# EasyEDA Pro project Octoslime_Haptics.eprj

# Schematic Octoslime

## Sheets
1 I2C breakout and OLED
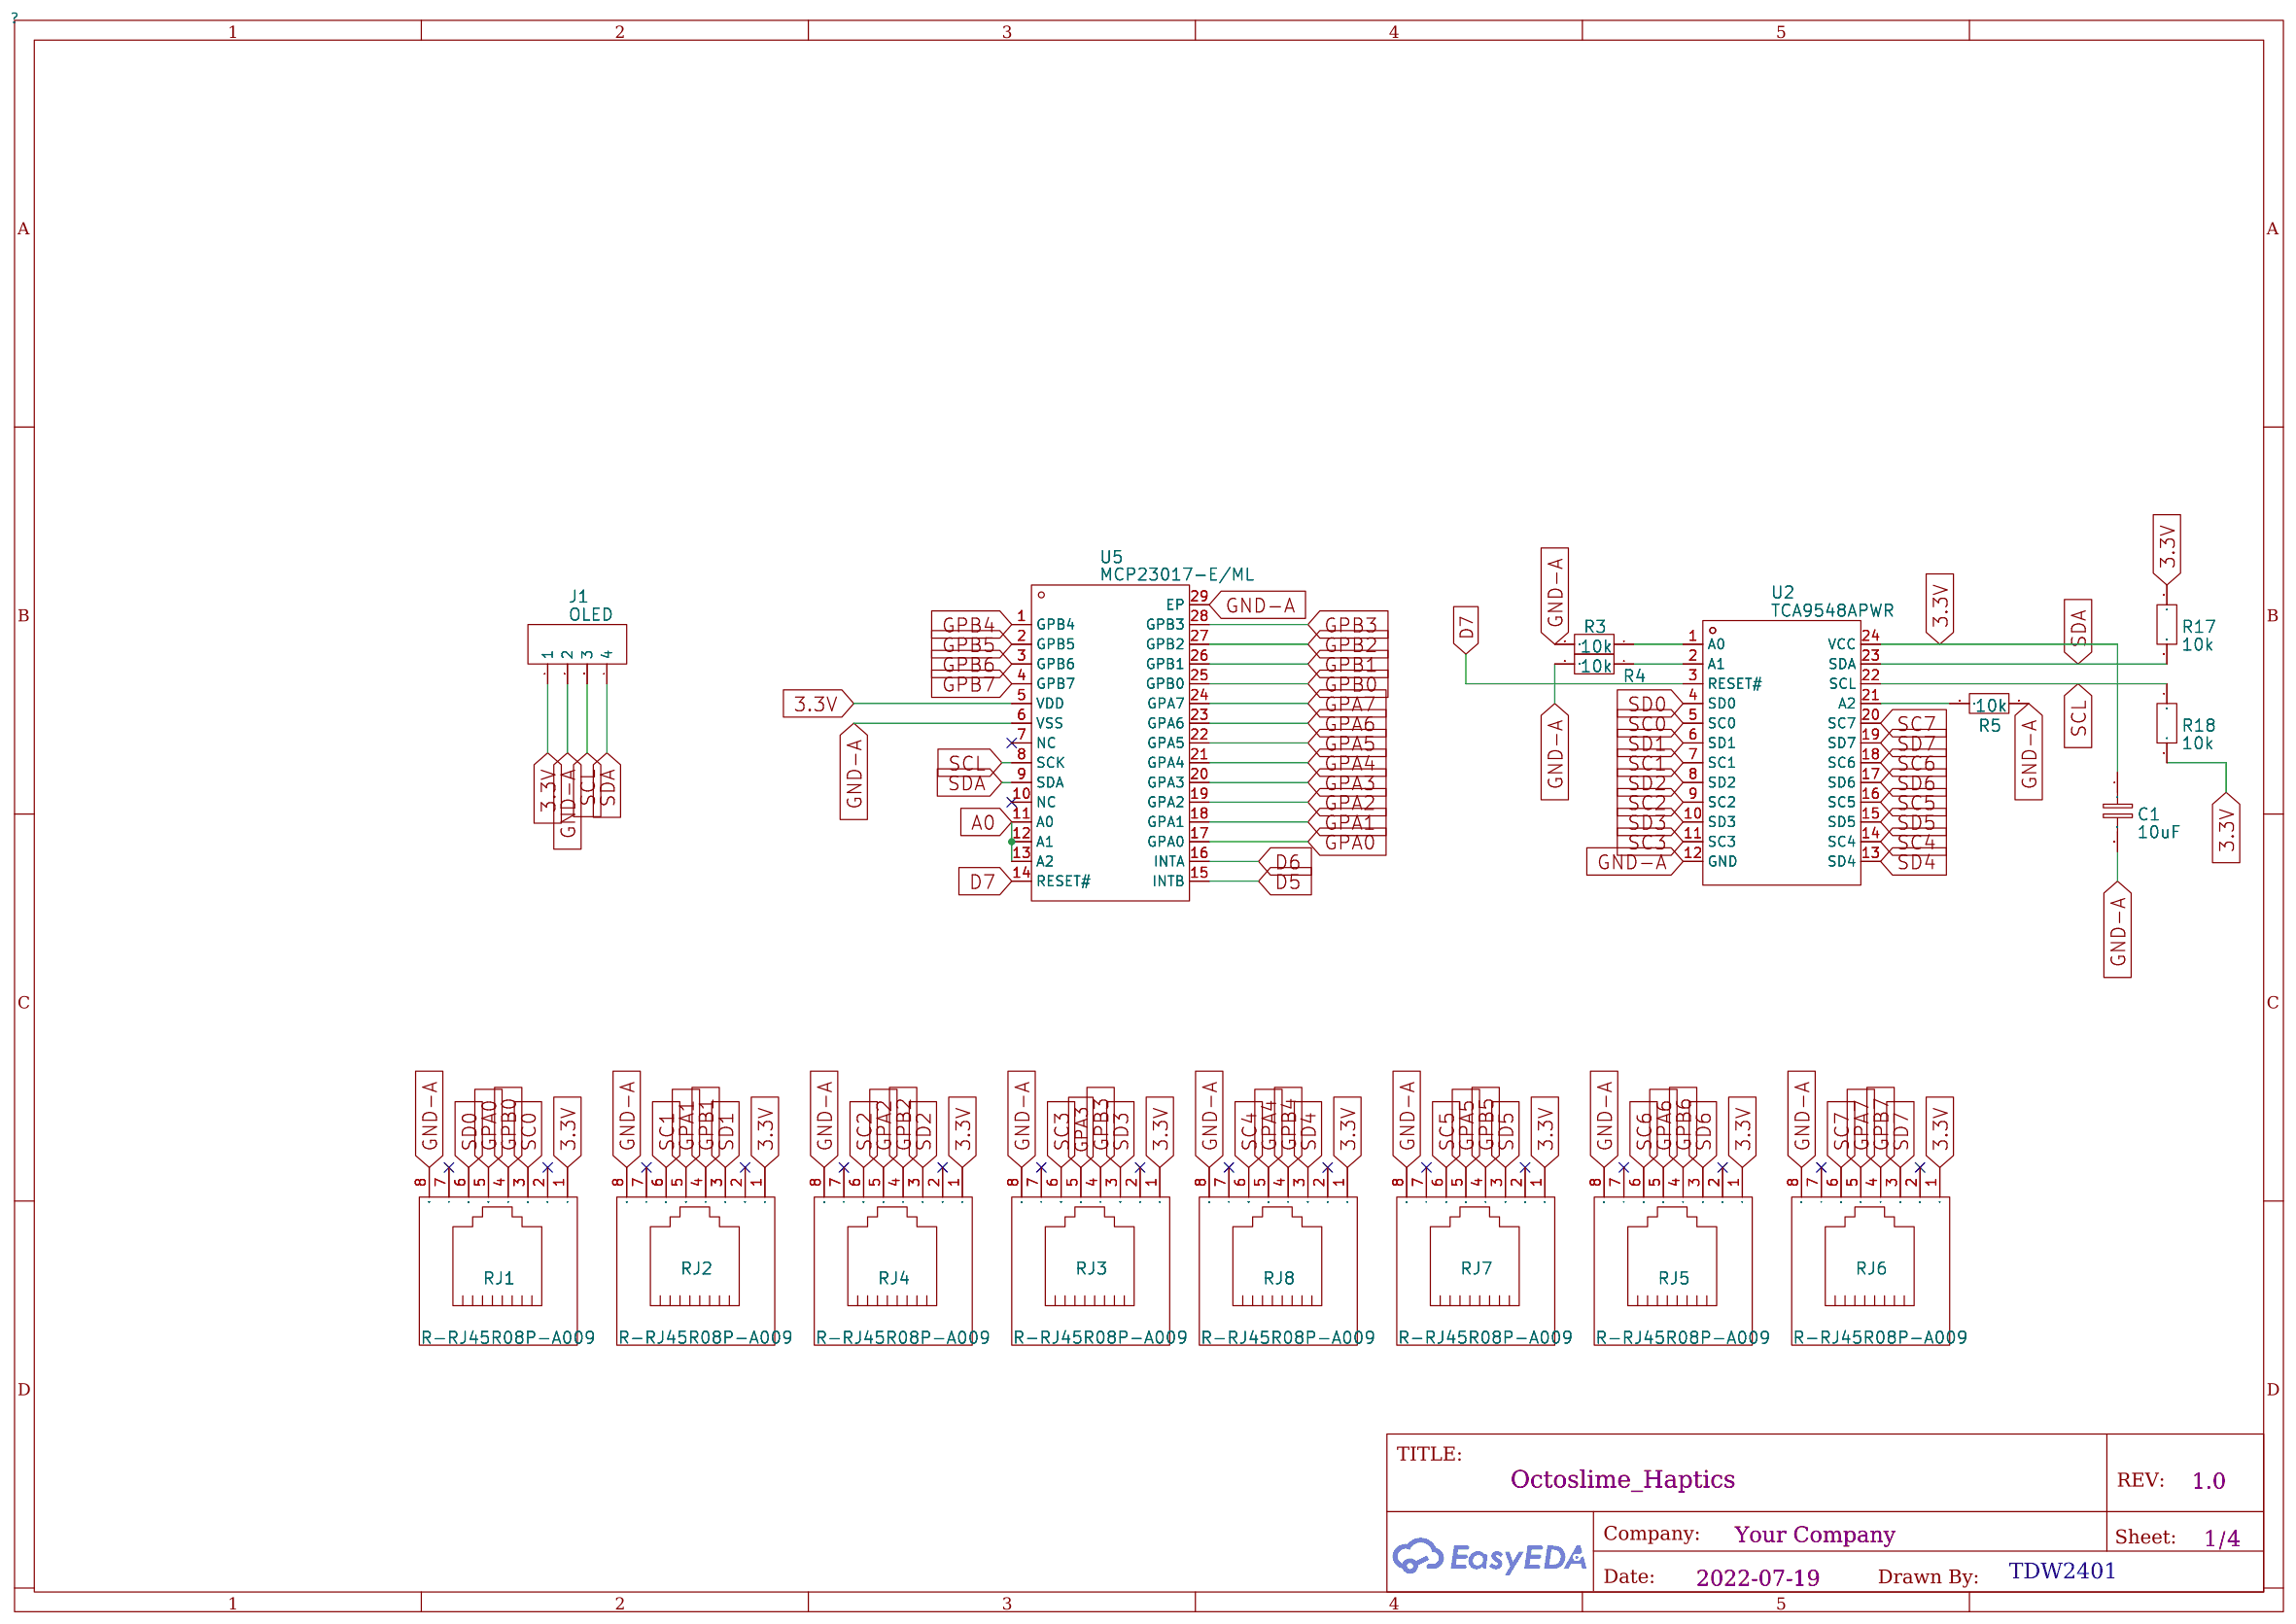
[diagram p0: I2C breakout and OLED]
2 Charge / data
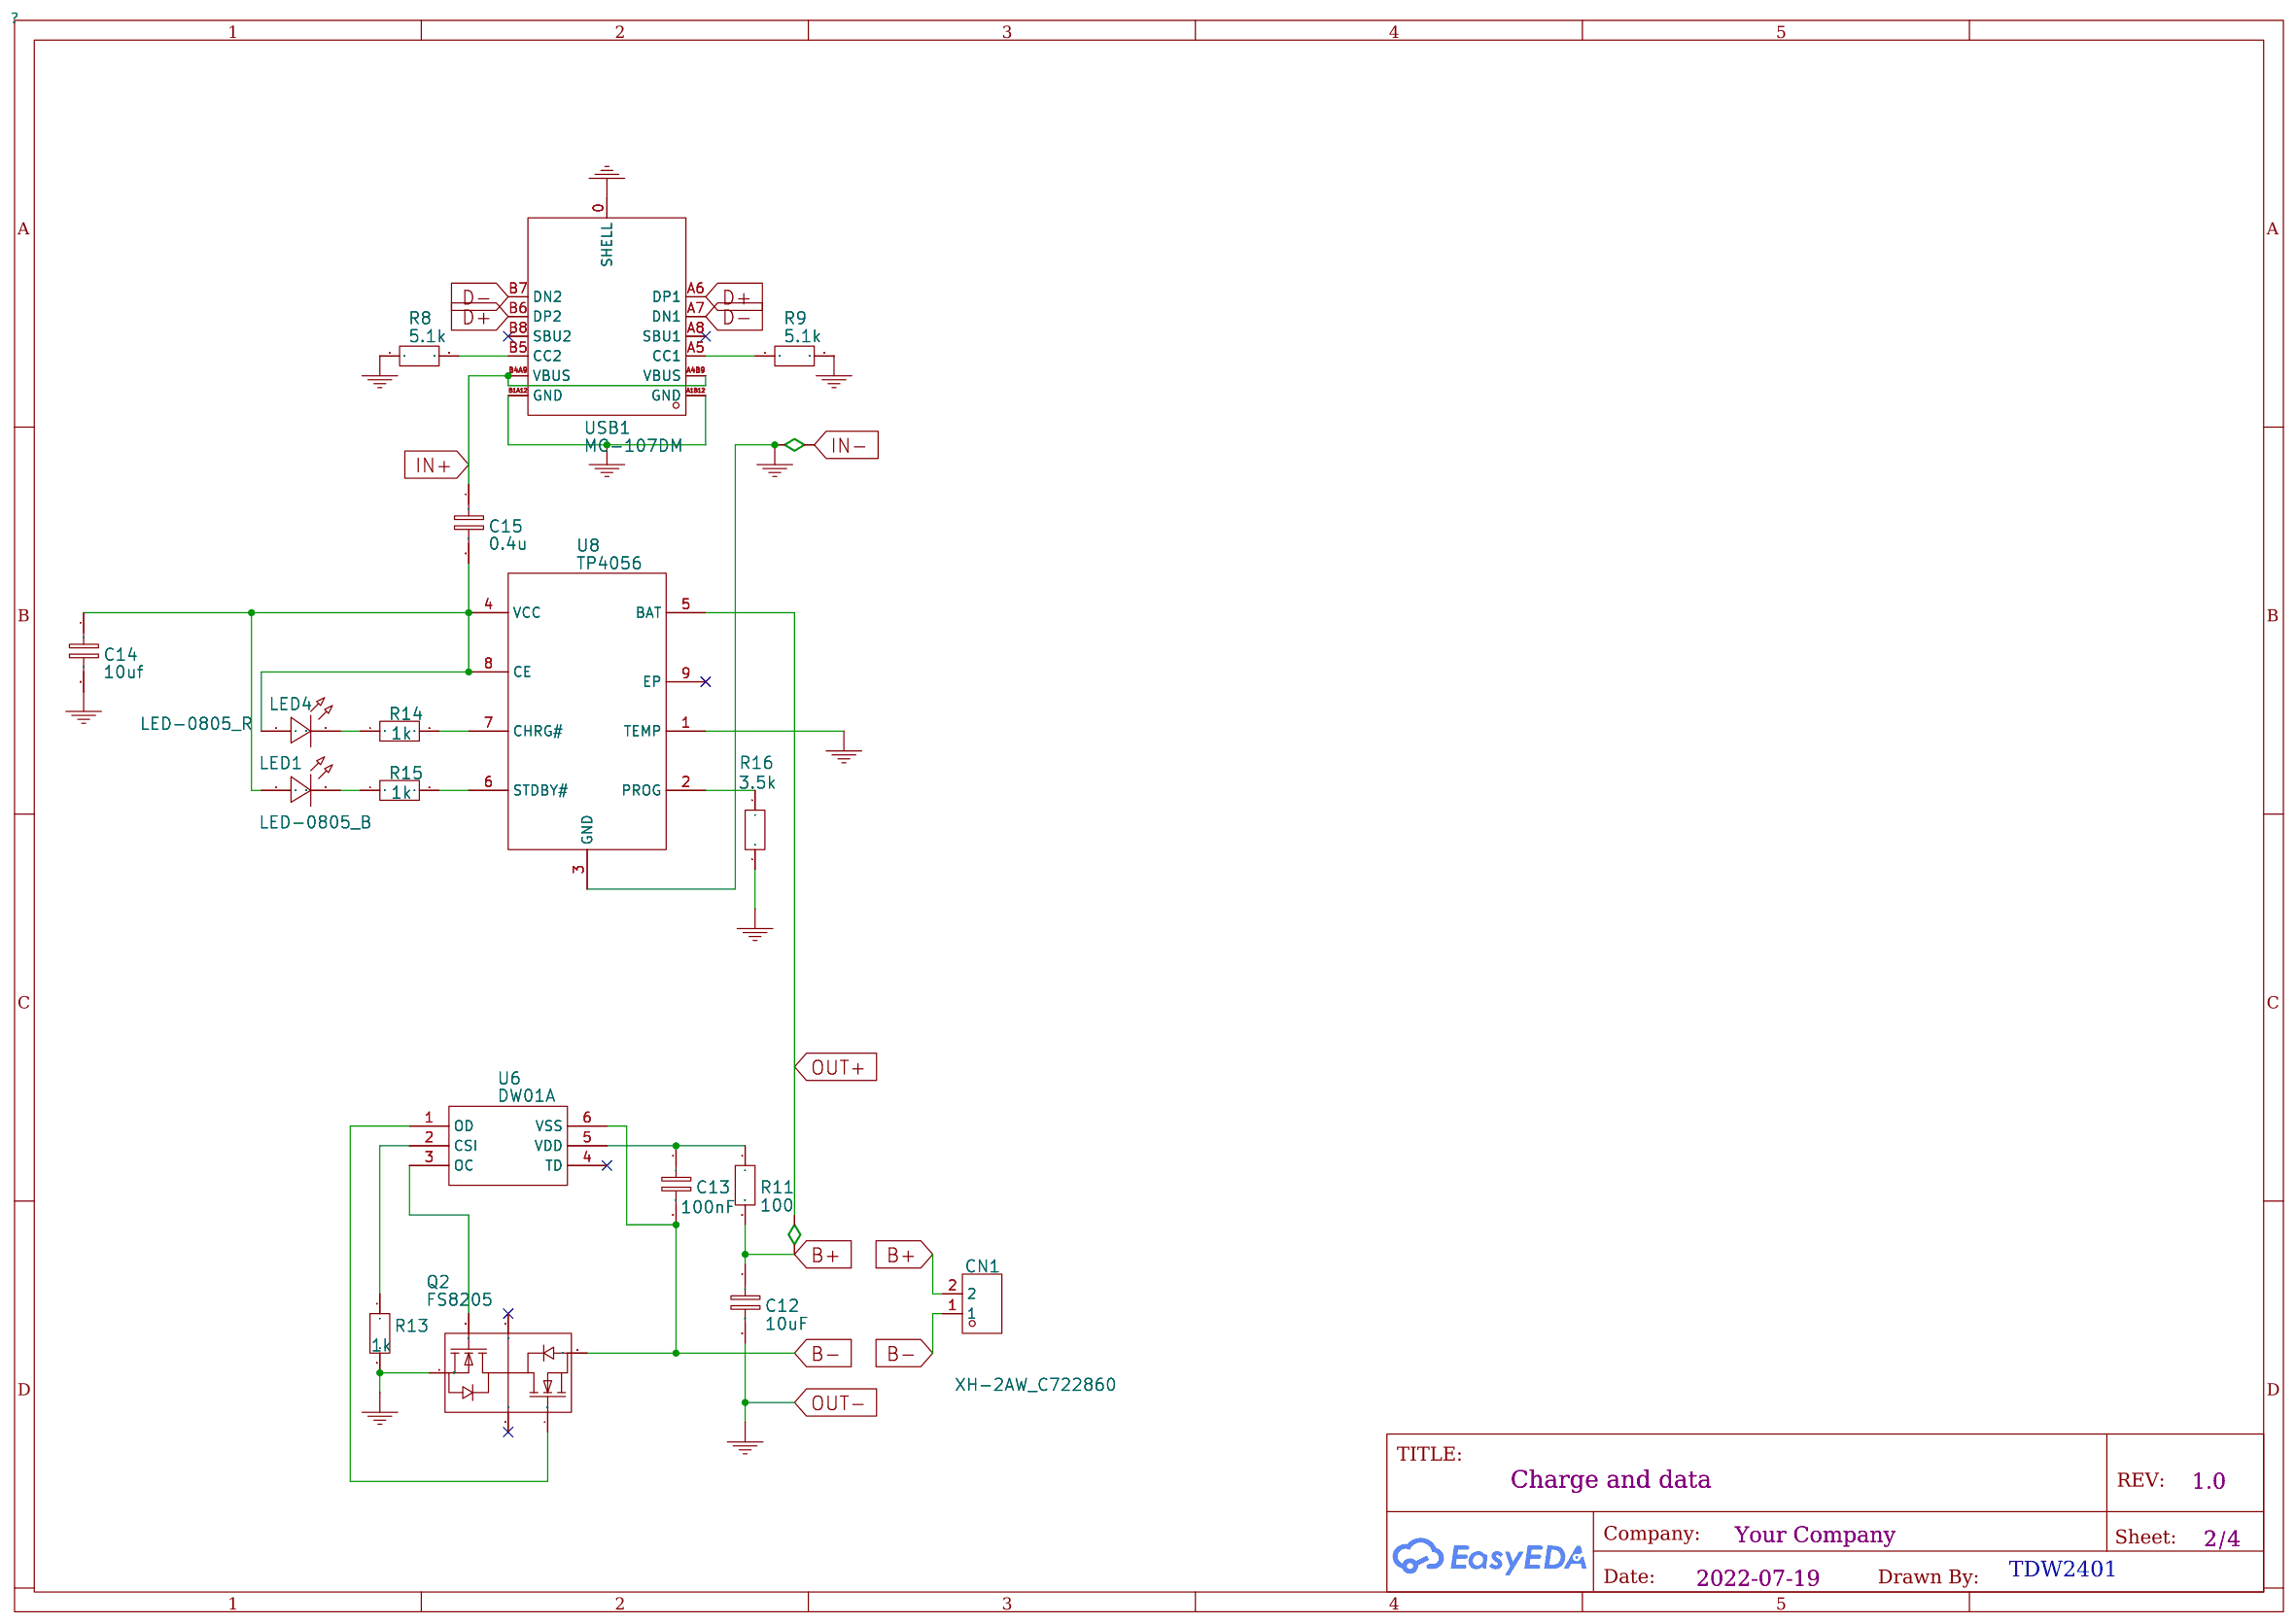
[diagram p1: Charge / data]
3 MCU
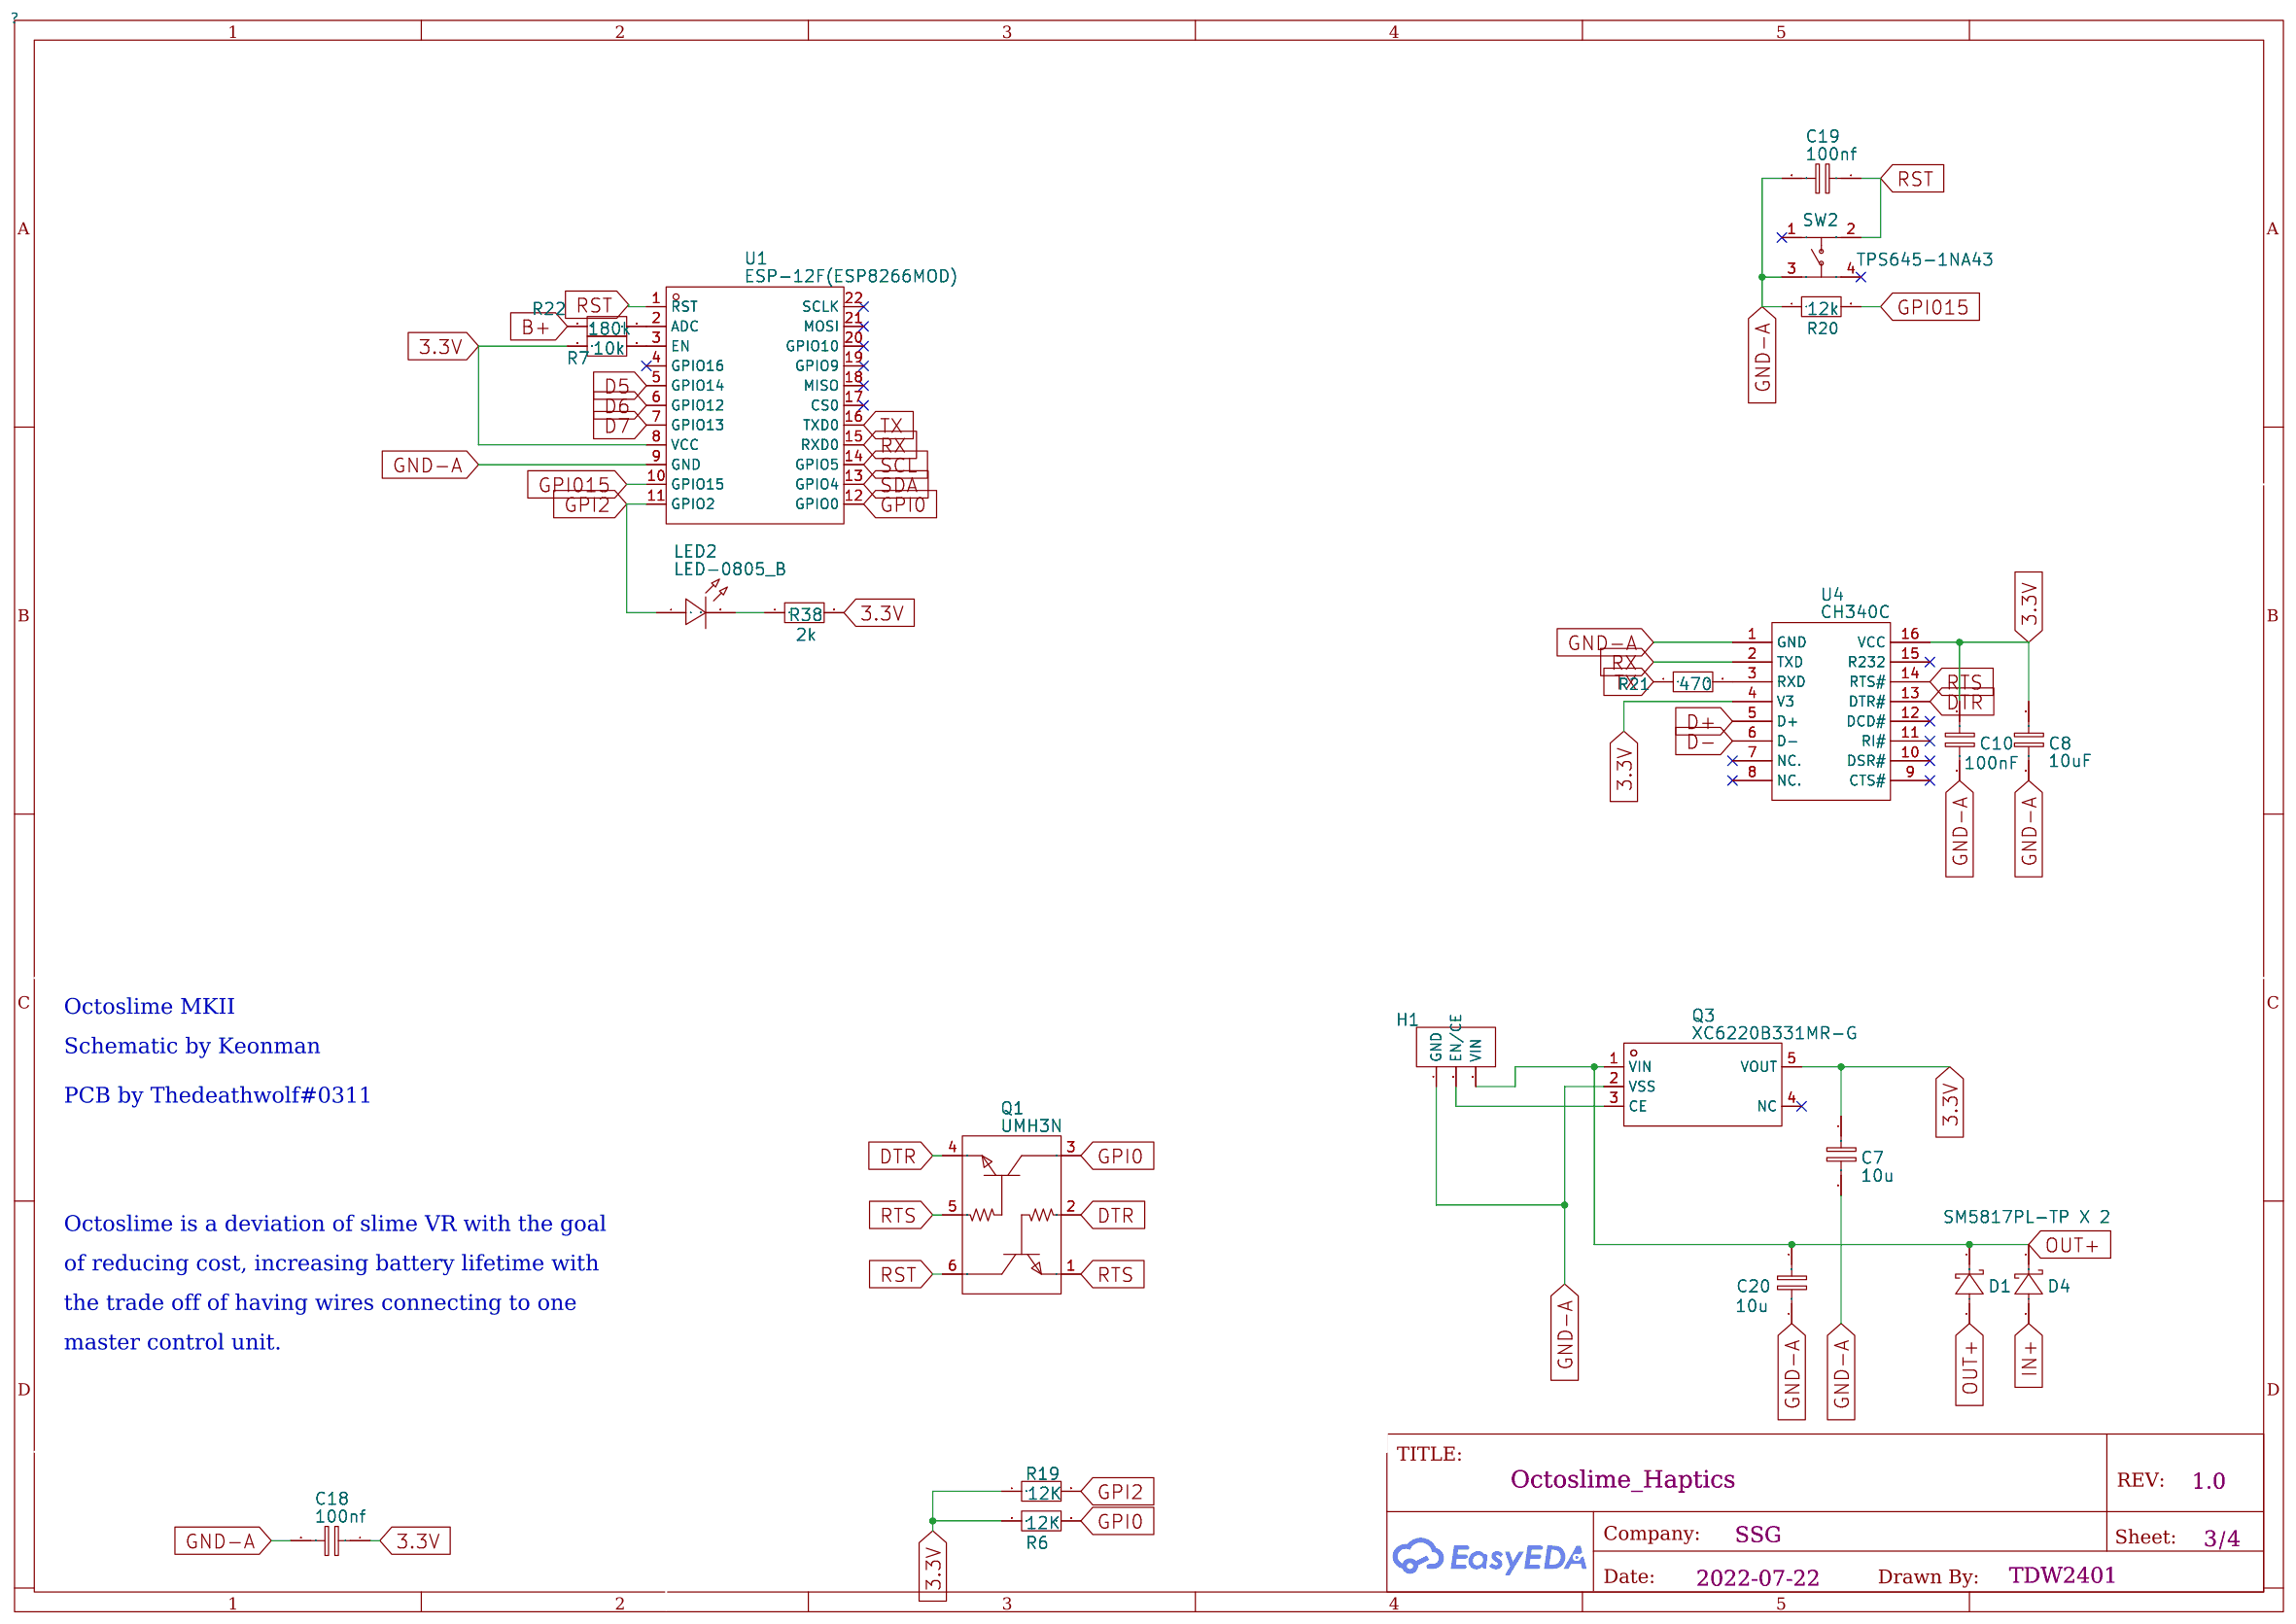
[diagram p2: MCU]
4 I2C thing - ma - jigXC6220B331PR-G
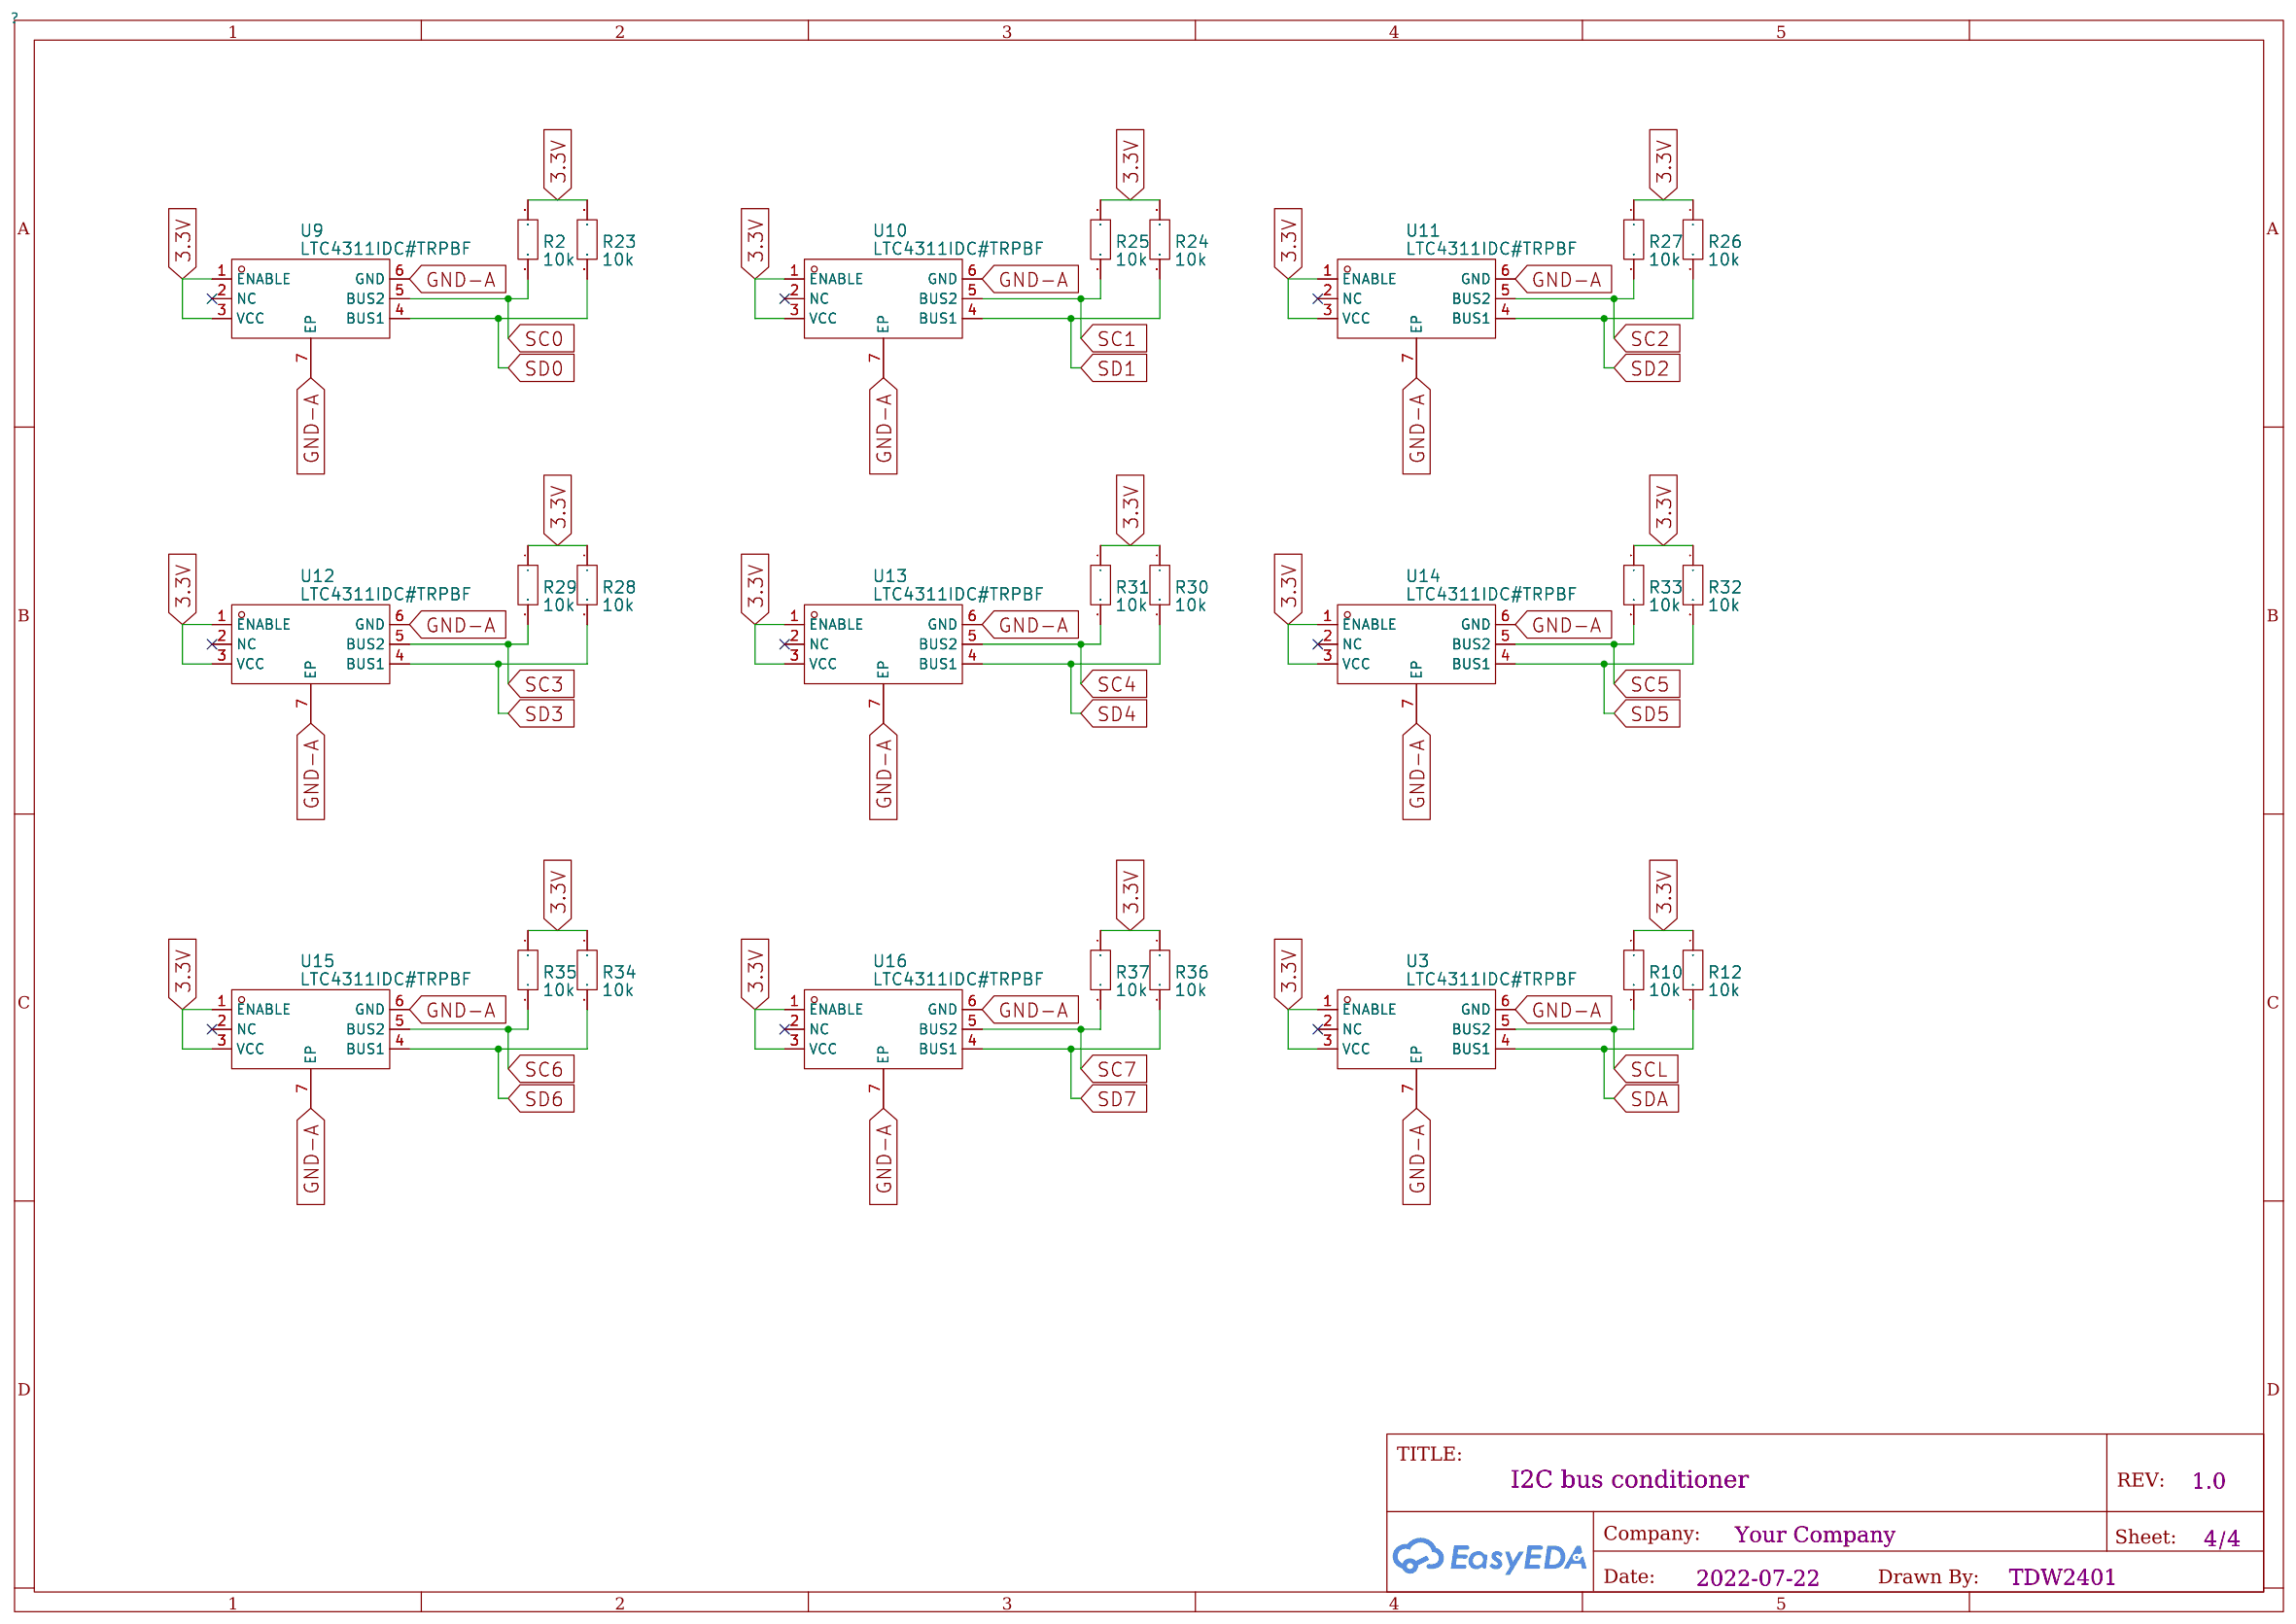
[diagram p3: I2C thing - ma - jigXC6220B331PR-G]

## Parts
sheet Charge / data
C12  10uF  [C0805]
C13  100nF  [C0805]
C14  10uf  [C0805]
C15  0.4u  [C0805]
CN1  XH-2AW_C722860  [CONN-TH_XH-2AW_C722860]
LED1  LED-0805_B  [LED0805_BLUE]
LED4  LED-0805_R  [LED0805_RED]
Q2  FS8205  [SOT-23-6_L2.9-W1.6-P0.95-LS2.8-BR]
R8  5.1k  [R0805]
R9  5.1k  [R0805]
R11  100  [R0805]
R13  1k  [R0805]
R14  1k  [R0805]
R15  1k  [R0805]
R16  3.5k  [R0805]
U6  DW01A  [SOT-23-6_L2.9-W1.6-P0.95-LS2.8-BL]
U8  TP4056  [ESOP-8_L4.9-W3.9-P1.27-LS6.0-BL-EP]
USB1  MC-107DM  [USB-C-SMD_MC-107D]
sheet I2C breakout and OLED
C1  10uF  [C0805]
J1  OLED  [HDR-M-2.54_1X4]
R3  10k  [R0805]
R4  10k  [R0805]
R5  10k  [R0805]
R17  10k  [R0805]
R18  10k  [R0805]
RJ1  R-RJ45R08P-A009  [RJ45-TH_R-RJ45R08P-A009]
RJ2  R-RJ45R08P-A009  [RJ45-TH_R-RJ45R08P-A009]
RJ3  R-RJ45R08P-A009  [RJ45-TH_R-RJ45R08P-A009]
RJ4  R-RJ45R08P-A009  [RJ45-TH_R-RJ45R08P-A009]
RJ5  R-RJ45R08P-A009  [RJ45-TH_R-RJ45R08P-A009]
RJ6  R-RJ45R08P-A009  [RJ45-TH_R-RJ45R08P-A009]
RJ7  R-RJ45R08P-A009  [RJ45-TH_R-RJ45R08P-A009]
RJ8  R-RJ45R08P-A009  [RJ45-TH_R-RJ45R08P-A009]
U2  TCA9548APWR  [TSSOP-24_L7.8-W4.4-P0.65-LS6.4-BL]
U5  MCP23017-E/ML  [QFN-28_L6.0-W6.0-P0.65-BL-EP3.7]
sheet I2C thing - ma - jigXC6220B331PR-G
R2  10k  [R0805]
R10  10k  [R0805]
R12  10k  [R0805]
R23  10k  [R0805]
R24  10k  [R0805]
R25  10k  [R0805]
R26  10k  [R0805]
R27  10k  [R0805]
R28  10k  [R0805]
R29  10k  [R0805]
R30  10k  [R0805]
R31  10k  [R0805]
R32  10k  [R0805]
R33  10k  [R0805]
R34  10k  [R0805]
R35  10k  [R0805]
R36  10k  [R0805]
R37  10k  [R0805]
U3  LTC4311IDC#TRPBF  [DFN-6_L2.0-W2.0-P0.50-BL-EP]
U9  LTC4311IDC#TRPBF  [DFN-6_L2.0-W2.0-P0.50-BL-EP]
U10  LTC4311IDC#TRPBF  [DFN-6_L2.0-W2.0-P0.50-BL-EP]
U11  LTC4311IDC#TRPBF  [DFN-6_L2.0-W2.0-P0.50-BL-EP]
U12  LTC4311IDC#TRPBF  [DFN-6_L2.0-W2.0-P0.50-BL-EP]
U13  LTC4311IDC#TRPBF  [DFN-6_L2.0-W2.0-P0.50-BL-EP]
U14  LTC4311IDC#TRPBF  [DFN-6_L2.0-W2.0-P0.50-BL-EP]
U15  LTC4311IDC#TRPBF  [DFN-6_L2.0-W2.0-P0.50-BL-EP]
U16  LTC4311IDC#TRPBF  [DFN-6_L2.0-W2.0-P0.50-BL-EP]
sheet MCU
C7  10u  [C0805]
C8  10uF  [C0805]
C10  100nF  [C0805]
C18  100nf  [C0805]
C19  100nf  [C0805]
C20  10u  [C0805]
D1  SM5817PL-TP X 2  [SOD-123FL_L2.8-W1.7-LS3.6-RD]
D4  SM5817PL-TP X 2  [SOD-123FL_L2.8-W1.7-LS3.6-RD]
H1  HDR-F-2.54_1x3  [HDR-F-2.54_1X3]
LED2  LED-0805_B  [LED0805_BLUE]
Q1  UMH3N  [SC-70-6_L2.2-W1.3-P0.65-LS2.1-BR]
Q3  XC6220B331MR-G  [SOT-25-5_L3.0-W1.8-P0.95-LS3.0-BR]
R6  12K  [R0805]
R7  10k  [R0805]
R19  12K  [R0805]
R20  12k  [R0805]
R21  470  [R0805]
R22  180k  [R0805]
R38  2k  [R0805]
SW2  TPS645-1NA43  [SW-TH_4P-L6.0-W6.0-P4.50-LS6.5]
U1  ESP-12F(ESP8266MOD)  [WIFIM-SMD_ESP-12F-ESP8266MOD]
U4  CH340C  [SOP-16_L10.0-W3.9-P1.27-LS6.0-BL]

## Library data of the parts
C1 C8 C12 = 10uF: link: https://item.szlcsc.com/373011.html; 3DModel: C0805_L2.0-W1.3-H1.3
C10 C13 = 100nF: link: https://item.szlcsc.com/373011.html; 3DModel: C0805_L2.0-W1.3-H1.3
C14 = 10uf: link: https://item.szlcsc.com/373011.html; 3DModel: C0805_L2.0-W1.3-H1.3
C15 = 0.4u: link: https://item.szlcsc.com/373011.html; 3DModel: C0805_L2.0-W1.3-H1.3
CN1 = XH-2AW_C722860: link: https://item.szlcsc.com/767067.html?ref=editor&logined=true; Supplier: LCSC; Supplier Part: C722860; Manufacturer: CAX; Manufacturer Part: XH-2AW; JLCPCB Part Class: Extended Part
LED1 LED2 = LED-0805_B: 3DModel: LED0805_Blue; Manufacturer: 方舟 ARKLED; Manufacturer Part: D-B080508B1-KS2; Supplier Part: C108412
LED4 = LED-0805_R: 3DModel: LED0805_Red; Manufacturer: EVERLIGHT(台湾亿光); Manufacturer Part: 17-21SURC/S530-A3/TR8; Supplier Part: C72037
Q2 = FS8205: link: https://item.szlcsc.com/169042.html; 3DModel: SOT-23-6_L2.9-W1.6-H1.5-LS2.8-P0.95; Supplier: LCSC; Manufacturer: FORTUNE; Supplier Part: C32254; JLCPCB Part Class: Extended Part
R8 R9 = 5.1k: link: https://item.szlcsc.com/142685.html; 3DModel: R0805_L2.0-W1.3-H0.6
R11 = 100: link: https://item.szlcsc.com/142685.html; 3DModel: R0805_L2.0-W1.3-H0.6
R13-R15 = 1k: link: https://item.szlcsc.com/142685.html; 3DModel: R0805_L2.0-W1.3-H0.6
R16 = 3.5k: link: https://item.szlcsc.com/142685.html; 3DModel: R0805_L2.0-W1.3-H0.6
U6 = DW01A: link: https://item.szlcsc.com/169042.html; 3DModel: SOT-23-6_L2.9-W1.6-H1.5-LS2.8-P0.95; Supplier: LCSC; Manufacturer: FM; Supplier Part: C85680; JLCPCB Part Class: Extended Part
U8 = TP4056: link: https://www.mornsun.cn/html/pdf/SCM1501B.html; 3DModel: ESOP-8_L4.9-W3.9-H1.6-LS6.0-P1.27; Supplier: LCSC; Manufacturer: TOPPOWER; Supplier Part: C16581; JLCPCB Part Class: Basic Part
USB1 = MC-107DM: link: https://atta.szlcsc.com/upload/public/pdf/source/20210810/6DD818F077A767CCD2FDFBDED48F58DC.pdf; Supplier: LCSC; Supplier Part: C2874569; Manufacturer: 台湾汉博; JLCPCB Part Class: Extended Part
J1 = OLED: 3DModel: HDR-M-2.54_1x4; Supplier Part: C124378; Supplier: LCSC
R2-R5 R7 R10 R12 R17 R18 R23-R37 = 10k: link: https://item.szlcsc.com/142685.html; 3DModel: R0805_L2.0-W1.3-H0.6
RJ1-RJ8 = R-RJ45R08P-A009: link: https://atta.szlcsc.com/upload/public/pdf/source/20211021/D54662BD8381AD1D1DF920996089EE18.pdf; Supplier: LCSC; Supplier Part: C2902700; Manufacturer: Ckmtw(灿科盟); JLCPCB Part Class: Extended Part
U2 = TCA9548APWR: link: https://item.szlcsc.com/6601.html; 3DModel: TSSOP-24_L7.8-W4.4-H1.0-LS6.4-P0.65; Supplier: LCSC; Manufacturer: TI; Supplier Part: C130026; JLCPCB Part Class: Extended Part
U5 = MCP23017-E/ML: link: https://list.szlcsc.com/brand/169.html; Supplier: LCSC; Supplier Part: C639770; Manufacturer: MICROCHIP(美国微芯); JLCPCB Part Class: Extended Part
U3 U9-U16 = LTC4311IDC#TRPBF: link: https://item.szlcsc.com/216405.html; 3DModel: DFN-6_L2.0-W2.0-H0.8-P0.50; Supplier: LCSC; Supplier Part: C688096; Manufacturer: Analog Devices; JLCPCB Part Class: Extended Part
C7 C20 = 10u: link: https://item.szlcsc.com/373011.html; 3DModel: C0805_L2.0-W1.3-H1.3
C18 C19 = 100nf: link: https://item.szlcsc.com/373011.html; 3DModel: C0805_L2.0-W1.3-H1.3
D1 D4 = SM5817PL-TP X 2: link: https://item.szlcsc.com/771782.html; Supplier: LCSC; Supplier Part: C669022; Manufacturer: MCC(Micro Commercial Components); Manufacturer Part: SM5817PL-TP; JLCPCB Part Class: Extended Part
H1 = HDR-F-2.54_1x3: link: https://www.cjt.com/Upload/A2541.pdf; Supplier Part: C146690; Supplier: LCSC
Q1 = UMH3N: link: https://item.szlcsc.com/112963.html; 3DModel: SC-70-6_L2.1-W1.3-H1.0-LS2.1-P0.65; Supplier: LCSC; Manufacturer: CJ; Supplier Part: C62892; JLCPCB Part Class: Extended Part
Q3 = XC6220B331MR-G: link: https://item.szlcsc.com/70677.html; 3DModel: SOT-25-5_L3.0-W1.6-H1.3-LS2.8-P0.95; Supplier: LCSC; Manufacturer: TOREX; Supplier Part: C86534; JLCPCB Part Class: Extended Part
R6 R19 = 12K: link: https://item.szlcsc.com/142685.html; 3DModel: R0805_L2.0-W1.3-H0.6
R20 = 12k: link: https://item.szlcsc.com/142685.html; 3DModel: R0805_L2.0-W1.3-H0.6
R21 = 470: link: https://item.szlcsc.com/142685.html; 3DModel: R0805_L2.0-W1.3-H0.6
R22 = 180k: link: https://item.szlcsc.com/142685.html; 3DModel: R0805_L2.0-W1.3-H0.6
R38 = 2k: link: https://item.szlcsc.com/142685.html; 3DModel: R0805_L2.0-W1.3-H0.6
SW2 = TPS645-1NA43: link: https://item.szlcsc.com/14483.html; 3DModel: SW-TH_4P-L6.0-W6.0-H5.0-LS6.5-P4.50; Supplier: LCSC; Supplier Part: C2828575; Manufacturer: ROCPU(台普); JLCPCB Part Class: Extended Part
U1 = ESP-12F(ESP8266MOD): link: https://item.szlcsc.com/84052.html; 3DModel: WIFIM-SMD_WIFI-L24.0-W16.0-H3.1; Supplier: LCSC; Manufacturer: Ai-Thinker; Supplier Part: C82891; JLCPCB Part Class: Extended Part
U4 = CH340C: link: https://item.szlcsc.com/391677.html; Supplier Part: C84681; Supplier: LCSC; 3DModel: SOP-16_L9.9-W3.9-H1.5-LS6.0-P1.27; Manufacturer: WCH; JLCPCB Part Class: Extended Part

## Nets
3.3V: C1.1 C7.1 C8.1 C10.1 C18.1 J1.1 Q3.5(VOUT) R2.1 R6.1 R7.1 R10.1 R12.1 R17.1 R18.2 R19.1 R23.1 R24.1 R25.1 R26.1 R27.1 R28.1 R29.1 R30.1 R31.1 R32.1 R33.1 R34.1 R35.1 R36.1 R37.1 R38.2 RJ1.1 RJ2.1 RJ3.1 RJ4.1 RJ5.1 RJ6.1 RJ7.1 RJ8.1 U1.8(VCC) U2.24(VCC) U3.1(ENABLE) U3.3(VCC) U4.4(V3) U4.16(VCC) U5.5(VDD) U9.1(ENABLE) U9.3(VCC) U10.1(ENABLE) U10.3(VCC) U11.1(ENABLE) U11.3(VCC) U12.1(ENABLE) U12.3(VCC) U13.1(ENABLE) U13.3(VCC) U14.1(ENABLE) U14.3(VCC) U15.1(ENABLE) U15.3(VCC) U16.1(ENABLE) U16.3(VCC)
GND: C12.2 C14.2 Q2.1(S1) R8.1 R9.2 R13.2 R16.2 U8.1(TEMP) U8.3(GND) USB1.0(SHELL) USB1.A1B12(GND) USB1.B1A12(GND)
GND-A: C1.2 C7.2 C8.2 C10.2 C18.2 C19.2 C20.2 H1.1(GND) J1.2 Q3.2(VSS) R3.2 R4.2 R5.1 R20.1 RJ1.8 RJ2.8 RJ3.8 RJ4.8 RJ5.8 RJ6.8 RJ7.8 RJ8.8 SW2.3 U1.9(GND) U2.12(GND) U3.6(GND) U3.7(EP) U4.1(GND) U5.6(VSS) U5.29(EP) U9.6(GND) U9.7(EP) U10.6(GND) U10.7(EP) U11.6(GND) U11.7(EP) U12.6(GND) U12.7(EP) U13.6(GND) U13.7(EP) U14.6(GND) U14.7(EP) U15.6(GND) U15.7(EP) U16.6(GND) U16.7(EP)
A0: U5.11(A0) U5.12(A1) U5.13(A2)
B+: C12.1 C20.1 CN1.2 D1.1(C) D1.2(A) D4.1(C) H1.3(VIN) Q3.1(VIN) R11.2 R22.1 U8.5(BAT)
B-: C13.2 CN1.1 Q2.3(S2) U6.6(VSS)
D5: U1.5(GPIO14) U5.15(INTB)
D6: U1.6(GPIO12) U5.16(INTA)
D7: U1.7(GPIO13) U2.3(RESET#) U5.14(RESET#)
D+: U4.5(D+) USB1.A6(DP1) USB1.B6(DP2)
D-: U4.6(D-) USB1.A7(DN1) USB1.B7(DN2)
DTR: Q1.2(B) Q1.4(E) U4.13(DTR#)
GPA0: RJ1.5 U5.17(GPA0)
GPA1: RJ2.5 U5.18(GPA1)
GPA2: RJ4.5 U5.19(GPA2)
GPA3: RJ3.5 U5.20(GPA3)
GPA4: RJ8.5 U5.21(GPA4)
GPA5: RJ7.5 U5.22(GPA5)
GPA6: RJ5.5 U5.23(GPA6)
GPA7: RJ6.5 U5.24(GPA7)
GPB0: RJ1.4 U5.25(GPB0)
GPB1: RJ2.4 U5.26(GPB1)
GPB2: RJ4.4 U5.27(GPB2)
GPB3: RJ3.4 U5.28(GPB3)
GPB4: RJ8.4 U5.1(GPB4)
GPB5: RJ7.4 U5.2(GPB5)
GPB6: RJ5.4 U5.3(GPB6)
GPB7: RJ6.4 U5.4(GPB7)
GPI0: Q1.3(C) R6.2 U1.12(GPIO0)
GPI2: LED2.1 R19.2 U1.11(GPIO2)
GPI015: R20.2 U1.10(GPIO15)
IN+: C15.1 D4.2(A) USB1.A4B9(VBUS) USB1.B4A9(VBUS)
RST: C19.1 Q1.6(C) SW2.2 U1.1(RST)
RTS: Q1.1(E) Q1.5(B) U4.14(RTS#)
RX: U1.15(RXD0) U4.2(TXD)
SC0: R2.2 RJ1.3 U2.5(SC0) U9.5(BUS2)
SC1: R25.2 RJ2.6 U2.7(SC1) U10.5(BUS2)
SC2: R27.2 RJ4.6 U2.9(SC2) U11.5(BUS2)
SC3: R29.2 RJ3.6 U2.11(SC3) U12.5(BUS2)
SC4: R31.2 RJ8.6 U2.14(SC4) U13.5(BUS2)
SC5: R33.2 RJ7.6 U2.16(SC5) U14.5(BUS2)
SC6: R35.2 RJ5.6 U2.18(SC6) U15.5(BUS2)
SC7: R37.2 RJ6.6 U2.20(SC7) U16.5(BUS2)
SCL: J1.3 R10.2 R18.1 U1.14(GPIO5) U2.22(SCL) U3.5(BUS2) U5.8(SCK)
SD0: R23.2 RJ1.6 U2.4(SD0) U9.4(BUS1)
SD1: R24.2 RJ2.3 U2.6(SD1) U10.4(BUS1)
SD2: R26.2 RJ4.3 U2.8(SD2) U11.4(BUS1)
SD3: R28.2 RJ3.3 U2.10(SD3) U12.4(BUS1)
SD4: R30.2 RJ8.3 U2.13(SD4) U13.4(BUS1)
SD5: R32.2 RJ7.3 U2.15(SD5) U14.4(BUS1)
SD6: R34.2 RJ5.3 U2.17(SD6) U15.4(BUS1)
SD7: R36.2 RJ6.3 U2.19(SD7) U16.4(BUS1)
SDA: J1.4 R12.2 R17.2 U1.13(GPIO4) U2.23(SDA) U3.4(BUS1) U5.9(SDA)
TX: R21.1 U1.16(TXD0)
LED1_1: C14.1 C15.2 LED1.1 LED4.1 U8.4(VCC) U8.8(CE)
LED1_2: LED1.2 R15.1
LED2_2: LED2.2 R38.1
LED4_2: LED4.2 R14.1
Net-(H1-2): H1.2(EN/CE) Q3.3(CE)
R7_2: R7.2 U1.3(EN)
R8_2: R8.2 USB1.B5(CC2)
R9_1: R9.1 USB1.A5(CC1)
R21_2: R21.2 U4.3(RXD)
R22_2: R22.2 U1.2(ADC)
U2_1: R3.1 U2.1(A0)
U2_2: R4.1 U2.2(A1)
U2_21: R5.2 U2.21(A2)
U6_1: Q2.4(G2) U6.1(OD)
U6_2: R13.1 U6.2(CSI)
U6_3: Q2.6(G1) U6.3(OC)
U6_5: C13.1 R11.1 U6.5(VDD)
U8_2: R16.1 U8.2(PROG)
U8_6: R15.2 U8.6(STDBY#)
U8_7: R14.2 U8.7(CHRG#)

Not connected (* = marked no-connect by the designer): Q2 2(D12)* 5(D12)*; Q3 4(NC)*; RJ1 2* 7*; RJ2 2* 7*; RJ3 2* 7*; RJ4 2* 7*; RJ5 2* 7*; RJ6 2* 7*; RJ7 2* 7*; RJ8 2* 7*; SW2 1* 4*; U1 4(GPIO16)* 17(CS0)* 18(MISO)* 19(GPIO9)* 20(GPIO10)* 21(MOSI)* 22(SCLK)*; U3 2(NC)*; U4 7(NC.)* 8(NC.)* 9(CTS#)* 10(DSR#)* 11(RI#)* 12(DCD#)* 15(R232)*; U5 7(NC)* 10(NC)*; U6 4(TD)*; U8 9(EP)*; U9 2(NC)*; U10 2(NC)*; U11 2(NC)*; U12 2(NC)*; U13 2(NC)*; U14 2(NC)*; U15 2(NC)*; U16 2(NC)*; USB1 A8(SBU1)* B8(SBU2)*

## Notes on the sheets
sheet 1
- TDW2401
sheet 2
- TDW2401
sheet 3
- Octoslime MKII
- Schematic by Keonman
- PCB by Thedeathwolf#0311
- Octoslime is a deviation of slime VR with the goal
- of reducing cost, increasing battery lifetime with
- the trade off of having wires connecting to one
- master control unit.

# Board PCB_PCB_Octoslime_3_2022-08-10_PCB
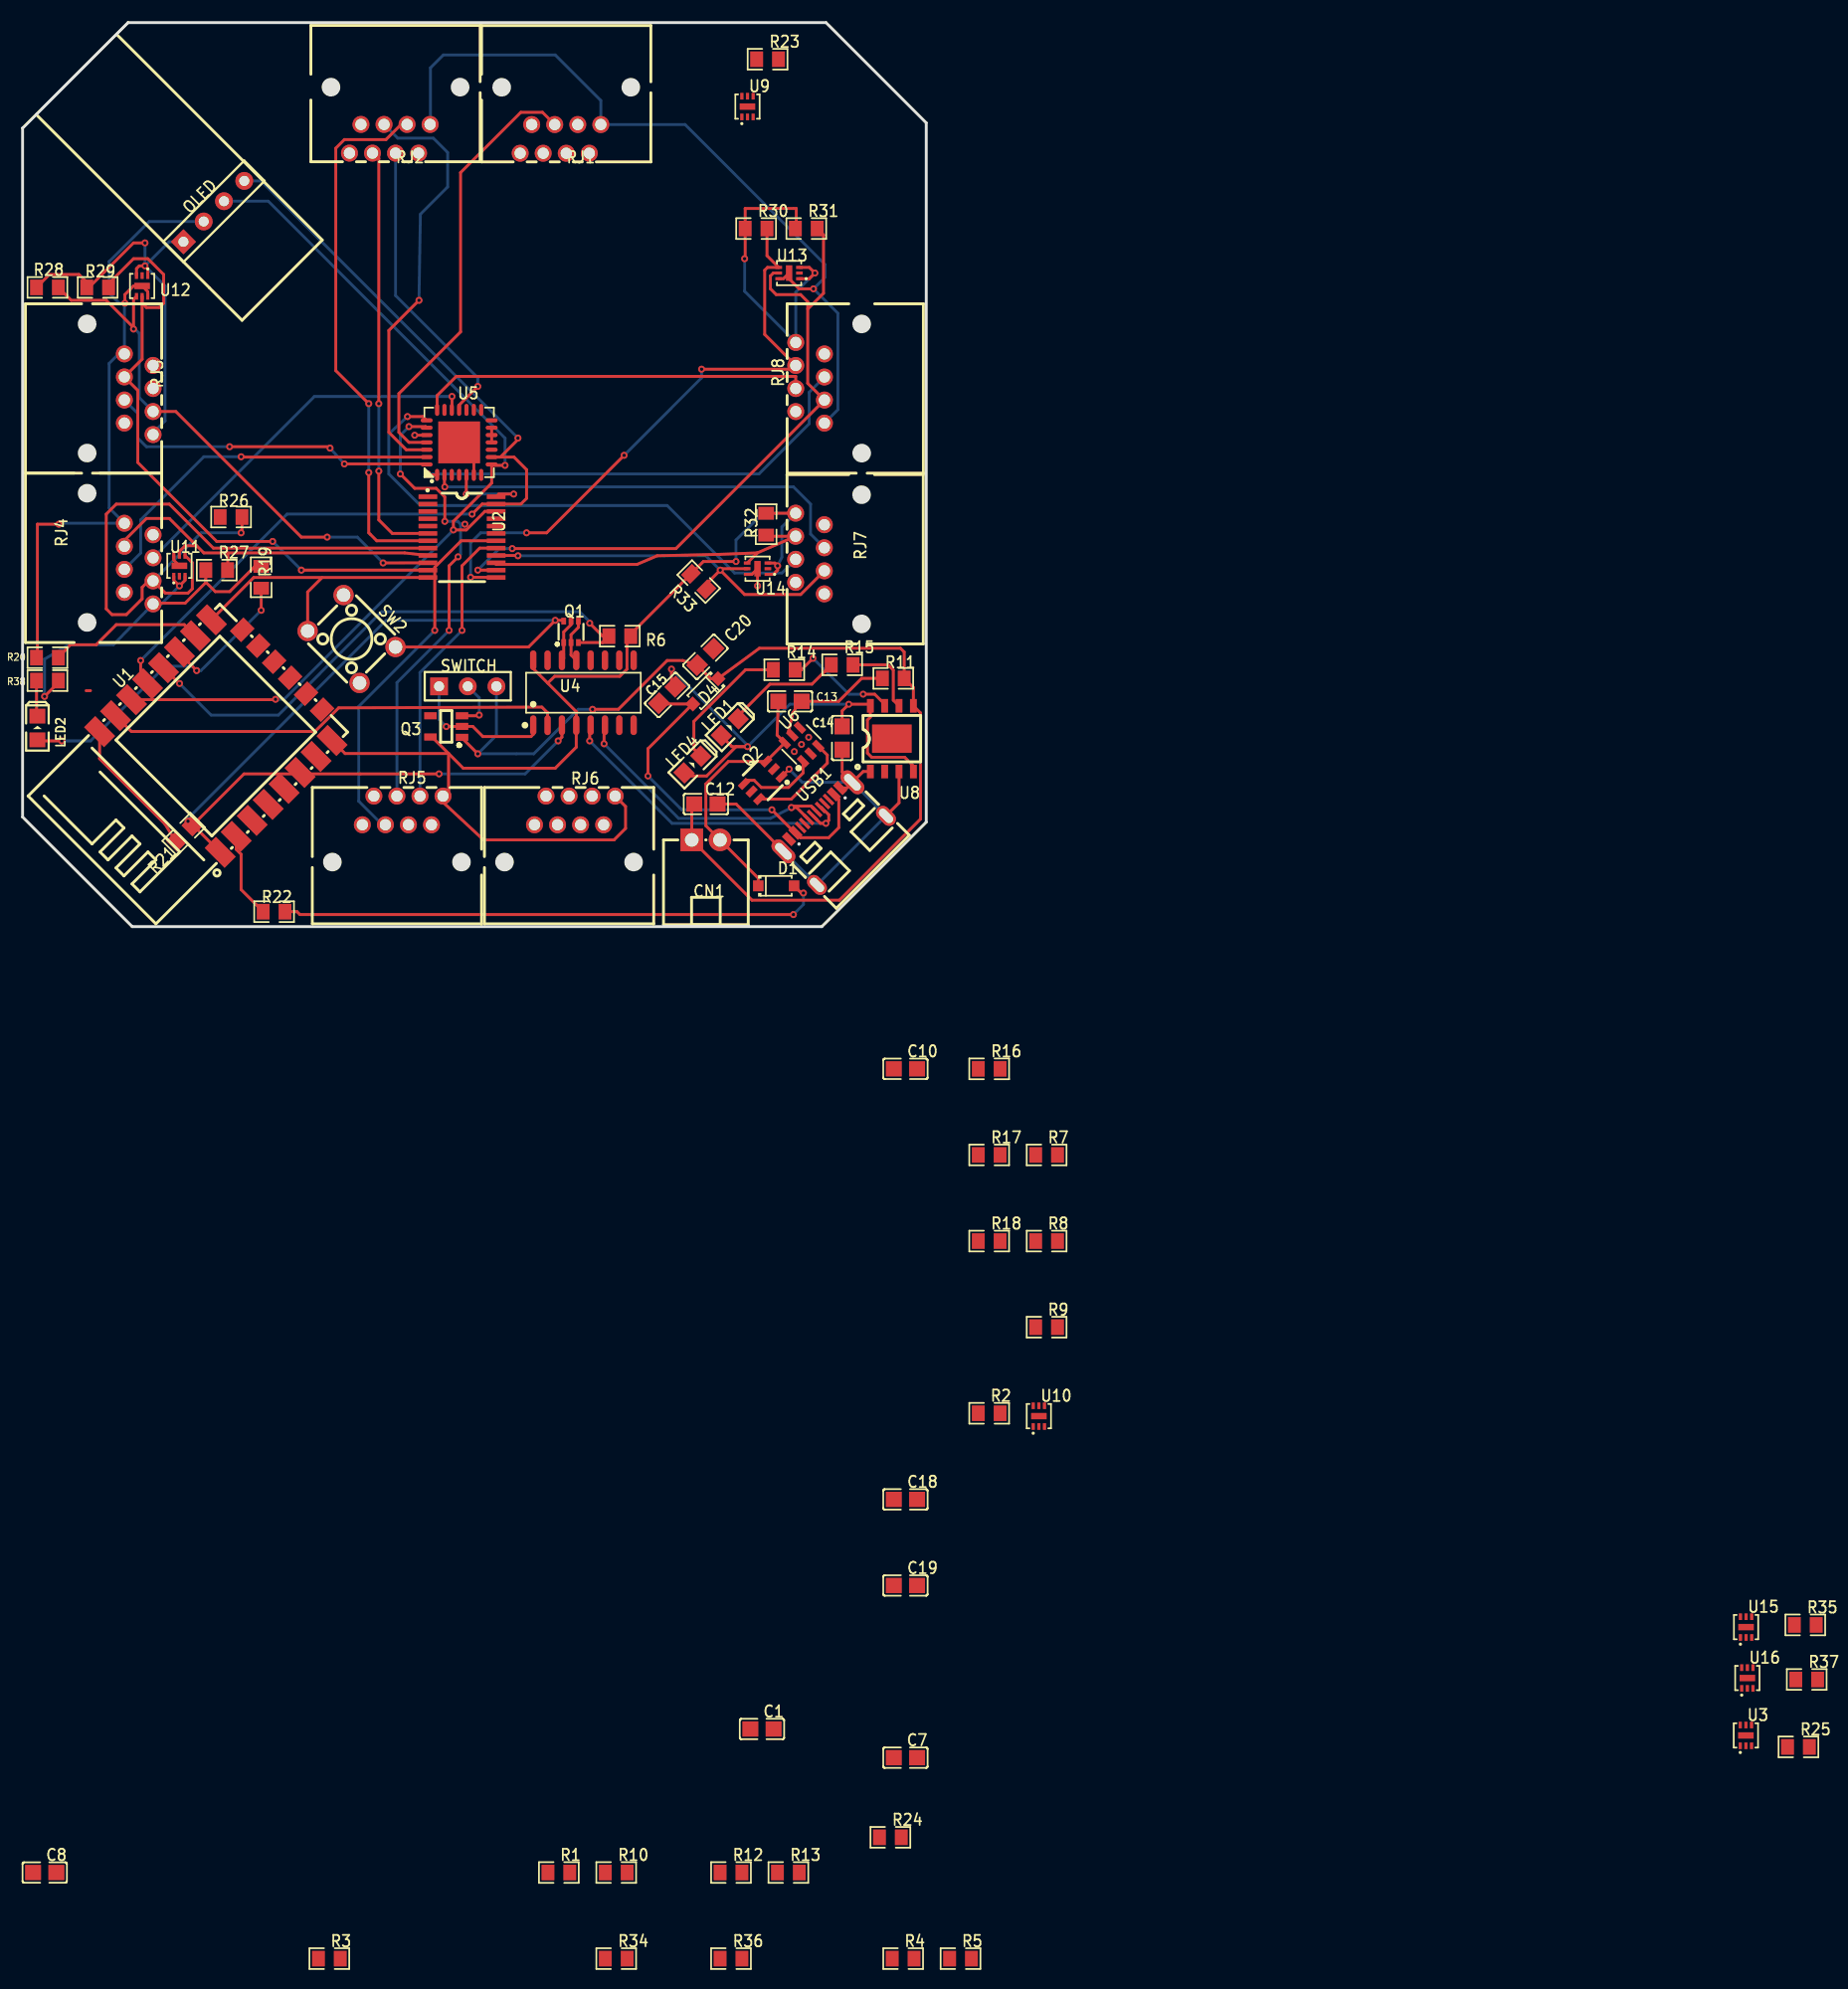
[diagram p4: board, top side]
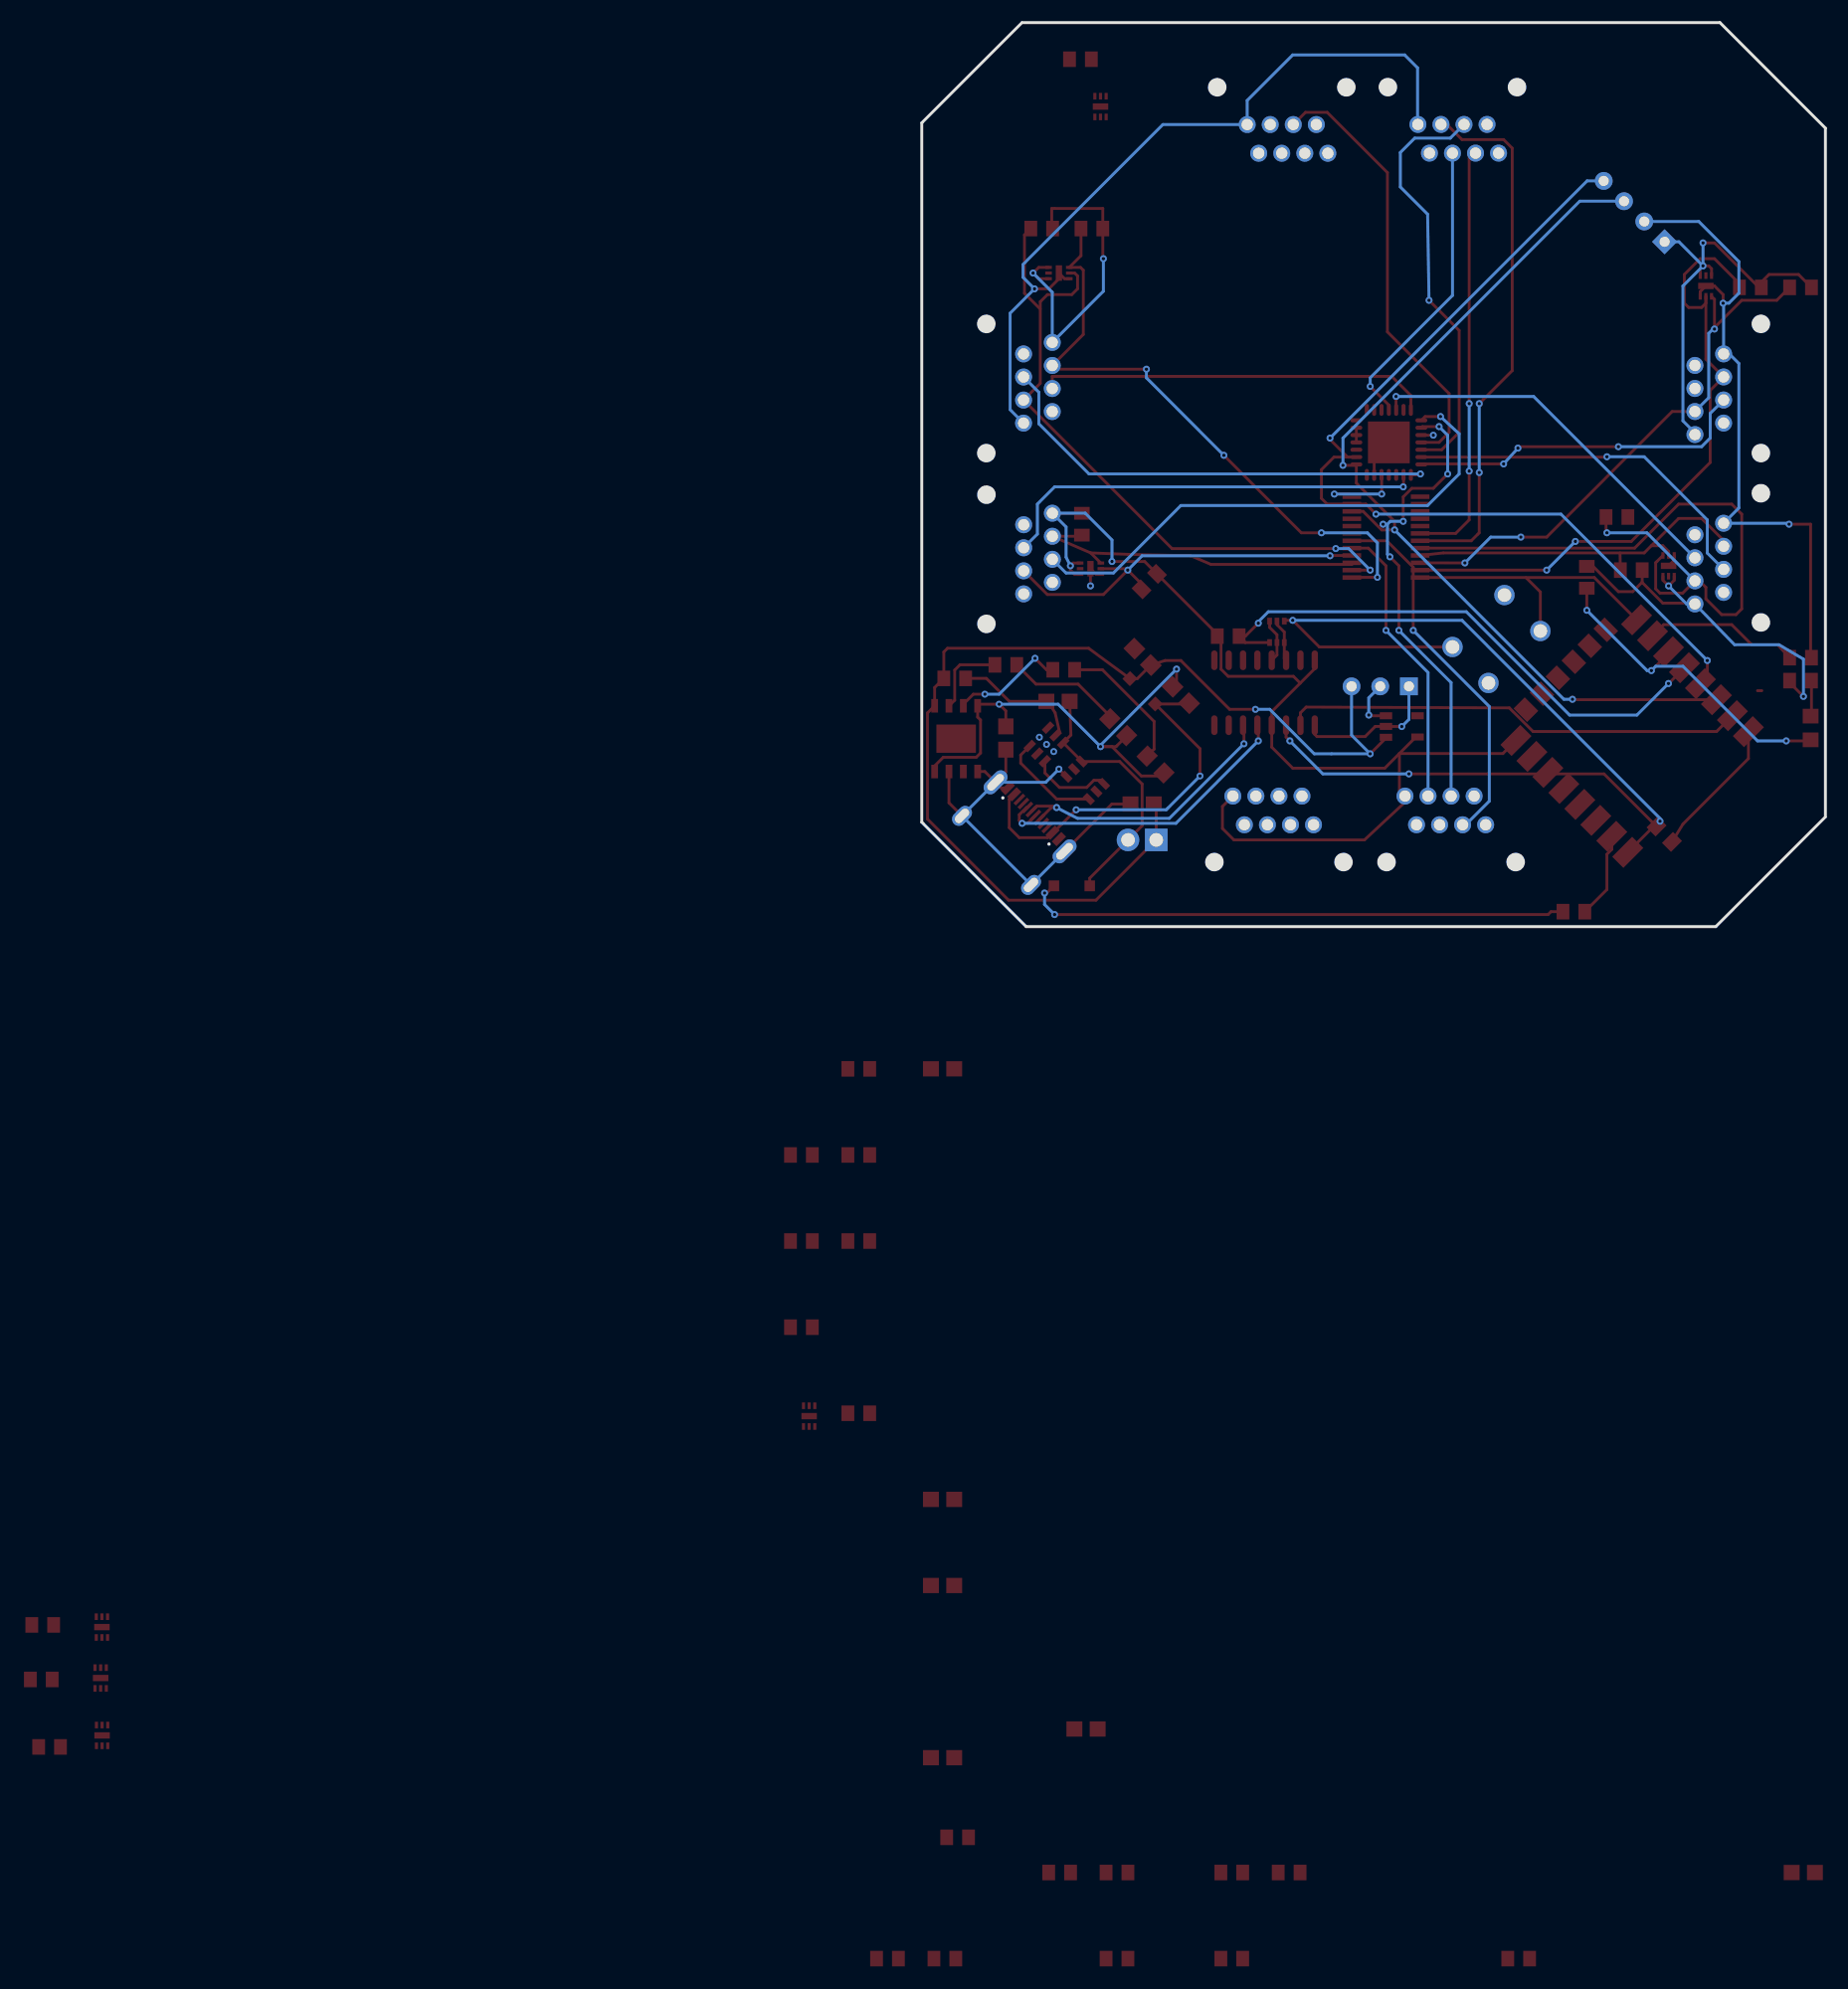
[diagram p5: board, bottom side, seen from below]

Outline 80 x 80 mm; copper layers: Top Layer, Bottom Layer. Coordinates in mm from the lower left corner of the outline.
Outline path: 0,70.66 9.34,80 71.12,80 80,71.12 80,9.24 70.76,0 9.7,0 0,9.7 0,70.66
Stack: Top Layer 0.035mm / Dielectric1 1.51mm FR4 er 4.5 / Bottom Layer 0.035mm

## Design rules (mm)
spacing Default (default): track to track 0.152, other pairs 0 to 0.152
track width Default (default): min 0.254, default 0.254, max 25.4
differential pair differentialPair (default): width min 0.127, default 0.254, max 2.54; gap min 0.152, default 0.152
via Default (default): diameter min 0.61, default 0.61, max 100.025; hole min 0.305, default 0.305, max 59.995

## Placement (name value [footprint] x y rotation side)
C1  10uF  [C0805]  65.46 -71.01 0 top
C7  10u  [C0805]  78.16 -73.55 0 top
C8  10uF  [C0805]  1.96 -83.71 0 top
C10  100nF  [C0805]  78.16 -12.59 0 top
C12  10uF  [C0805]  60.49 10.85 0 top
C13  100nF  [C0805]  67.94 19.93 180 top
C14  10uf  [C0805]  72.56 16.69 270 top
C15  0.4u  [C0805]  57.06 20.5 45 top
C18  100nf  [C0805]  78.16 -50.69 0 top
C19  100nf  [C0805]  78.16 -58.31 0 top
C20  10u  [C0805]  60.45 23.87 45 top
CN1  XH-2AW_C722860  [CONN-TH_XH-2AW_C722860]  60.49 7.67 0 top
D1  SM5817PL-TP X 2  [SOD-123FL_L2.8-W1.7-LS3.6-RD]  66.72 3.61 0 top
D4  SM5817PL-TP X 2  [SOD-123FL_L2.8-W1.7-LS3.6-RD]  60.45 20.82 225 top
LED1  LED-0805_B  [LED0805_BLUE]  62.61 17.65 45 top
LED2  LED-0805_B  [LED0805_BLUE]  1.31 17.58 90 top
LED4  LED-0805_R  [LED0805_RED]  59.3 14.35 45 top
OLED  OLED  [HDR-M-2.54_1X4]  16.93 63.3 45 top
Q1  UMH3N  [SC-70-6_L2.2-W1.3-P0.65-LS2.1-BR]  48.55 26.09 270 top
Q2  FS8205  [SOT-23-6_L2.9-W1.6-P0.95-LS2.8-BR]  65.53 12.95 45 top
Q3  XC6220B331MR-G  [SOT-25-5_L3.0-W1.8-P0.95-LS3.0-BR]  37.51 17.7 0 top
R1  10k  [R0805]  47.48 -83.71 0 top
R2  10k  [R0805]  85.58 -43.07 0 top
R3  10k  [R0805]  27.16 -91.33 0 top
R4  10k  [R0805]  77.96 -91.33 0 top
R5  10k  [R0805]  83.04 -91.33 0 top
R6  12K  [R0805]  52.87 25.71 180 top
R7  10k  [R0805]  90.66 -20.21 0 top
R8  5.1k  [R0805]  90.66 -27.83 0 top
R9  5.1k  [R0805]  90.66 -35.45 0 top
R10  10k  [R0805]  52.56 -83.71 0 top
R11  100  [R0805]  77.08 21.97 0 top
R12  10k  [R0805]  62.72 -83.71 0 top
R13  1k  [R0805]  67.8 -83.71 0 top
R14  1k  [R0805]  67.43 22.73 0 top
R15  1k  [R0805]  72.56 23.17 0 top
R16  3.5k  [R0805]  85.58 -12.59 0 top
R17  10k  [R0805]  85.58 -20.21 0 top
R18  10k  [R0805]  85.58 -27.83 0 top
R19  12K  [R0805]  21.12 30.91 270 top
R20  12k  [R0805]  2.2 23.8 0 top
R21  470  [R0805]  14.27 8.18 45 top
R22  180k  [R0805]  22.27 1.32 180 top
R23  10k  [R0805]  65.95 76.76 0 top
R24  10k  [R0805]  76.83 -80.59 0 top
R25  10k  [R0805]  157.22 -72.59 0 top
R26  10k  [R0805]  18.46 36.25 0 top
R27  10k  [R0805]  17.19 31.55 0 top
R28  10k  [R0805]  2.2 56.57 0 top
R29  10k  [R0805]  6.65 56.57 0 top
R30  10k  [R0805]  64.94 61.77 0 top
R31  10k  [R0805]  69.38 61.77 0 top
R32  10k  [R0805]  65.83 35.61 270 top
R33  10k  [R0805]  59.86 30.53 315 top
R34  10k  [R0805]  52.56 -91.33 0 top
R35  10k  [R0805]  157.82 -61.8 0 top
R36  10k  [R0805]  62.72 -91.33 0 top
R37  10k  [R0805]  157.95 -66.62 0 top
R38  2k  [R0805]  2.2 21.77 0 top
RJ1  R-RJ45R08P-A009  [RJ45-TH_R-RJ45R08P-A009]  47.62 69.71 180 top
RJ2  R-RJ45R08P-A009  [RJ45-TH_R-RJ45R08P-A009]  32.51 69.72 180 top
RJ3  R-RJ45R08P-A009  [RJ45-TH_R-RJ45R08P-A009]  10.28 47.11 270 top
RJ4  R-RJ45R08P-A009  [RJ45-TH_R-RJ45R08P-A009]  10.28 32.13 270 top
RJ5  R-RJ45R08P-A009  [RJ45-TH_R-RJ45R08P-A009]  33.65 10.28 0 top
RJ6  R-RJ45R08P-A009  [RJ45-TH_R-RJ45R08P-A009]  48.89 10.28 0 top
RJ7  R-RJ45R08P-A009  [RJ45-TH_R-RJ45R08P-A009]  69.71 33.01 90 top
RJ8  R-RJ45R08P-A009  [RJ45-TH_R-RJ45R08P-A009]  69.72 48.13 90 top
SW2  TPS645-1NA43  [SW-TH_4P-L6.0-W6.0-P4.50-LS6.5]  29.12 25.45 315 top
SWITCH  HDR-F-2.54_1x3  [HDR-F-2.54_1X3]  39.41 21.26 0 top
U1  ESP-12F(ESP8266MOD)  [WIFIM-SMD_ESP-12F-ESP8266MOD]  17.57 17.32 45 top
U2  TCA9548APWR  [TSSOP-24_L7.8-W4.4-P0.65-LS6.4-BL]  38.9 34.47 270 top
U3  LTC4311IDC#TRPBF  [DFN-6_L2.0-W2.0-P0.50-BL-EP]  152.57 -71.58 0 top
U4  CH340C  [SOP-16_L10.0-W3.9-P1.27-LS6.0-BL]  49.65 20.7 0 top
U5  MCP23017-E/ML  [QFN-28_L6.0-W6.0-P0.65-BL-EP3.7]  38.65 42.85 0 top
U6  DW01A  [SOT-23-6_L2.9-W1.6-P0.95-LS2.8-BL]  68.96 16.12 45 top
U8  TP4056  [ESOP-8_L4.9-W3.9-P1.27-LS6.0-BL-EP]  76.96 16.63 0 top
U9  LTC4311IDC#TRPBF  [DFN-6_L2.0-W2.0-P0.50-BL-EP]  64.18 72.57 0 top
U10  LTC4311IDC#TRPBF  [DFN-6_L2.0-W2.0-P0.50-BL-EP]  89.97 -43.32 0 top
U11  LTC4311IDC#TRPBF  [DFN-6_L2.0-W2.0-P0.50-BL-EP]  13.88 31.93 0 top
U12  LTC4311IDC#TRPBF  [DFN-6_L2.0-W2.0-P0.50-BL-EP]  10.58 56.69 180 top
U13  LTC4311IDC#TRPBF  [DFN-6_L2.0-W2.0-P0.50-BL-EP]  67.86 57.84 90 top
U14  LTC4311IDC#TRPBF  [DFN-6_L2.0-W2.0-P0.50-BL-EP]  65.07 31.67 90 top
U15  LTC4311IDC#TRPBF  [DFN-6_L2.0-W2.0-P0.50-BL-EP]  152.58 -61.99 0 top
U16  LTC4311IDC#TRPBF  [DFN-6_L2.0-W2.0-P0.50-BL-EP]  152.69 -66.5 0 top
USB1  MC-107DM  [USB-C-SMD_MC-107D]  71.75 8.38 45 top

## Footprints (pads in the part's own frame, mm; a bottom-side part is the same pattern mirrored in y, then rotated)
C0805
  rect 1.41x1.35 smd: 1(-1.03,0) 2(1.03,0)
CONN-TH_XH-2AW_C722860
  rect 2x2 hole 1.2: 1(-1.25,0)
  round 2 hole 1.2: 2(1.25,0)
DFN-6_L2.0-W2.0-P0.50-BL-EP
  rect 0.28x0.585 smd: 1(-0.5,-0.917) 2(0,-0.917) 3(0.5,-0.917) 4(0.5,0.917) 5(0,0.917) 6(-0.5,0.917)
  rect 1.37x0.56 smd: 7(0,0)
ESOP-8_L4.9-W3.9-P1.27-LS6.0-BL-EP
  rect 0.6x1.2 smd: 1(-1.905,-2.909) 2(-0.635,-2.909) 3(0.635,-2.909) 4(1.905,-2.909) 5(1.905,2.909) 6(0.635,2.909) 7(-0.635,2.909) 8(-1.905,2.909)
  rect 3.5x2.5 smd: 9(0,0)
HDR-F-2.54_1X3
  rect 1.575x1.575 hole 0.889: 1(-2.54,0)
  round 1.575 hole 0.889: 2(0,0)
  round 1.575 hole 0.914: 3(2.54,0)
HDR-M-2.54_1X4
  rect 1.575x1.575 hole 0.889: 1(-3.81,0)
  round 1.575 hole 0.889: 2(-1.27,0) 3(1.27,0) 4(3.81,0)
LED0805_BLUE
  rect 1.3x1.399 smd: 1(-1.05,0) 2(1.05,0)
LED0805_RED
  rect 1.3x1.399 smd: 1(-1.05,0) 2(1.05,0)
QFN-28_L6.0-W6.0-P0.65-BL-EP3.7
  oval 0.364x1.055 smd: 1(-1.95,-2.877) 2(-1.3,-2.877) 3(-0.65,-2.877) 4(0,-2.877) 5(0.65,-2.877) 6(1.3,-2.877) 7(1.95,-2.877) 15(1.95,2.877) 16(1.3,2.877) 17(0.65,2.877) 18(0,2.877) 19(-0.65,2.877) 20(-1.3,2.877) 21(-1.95,2.877)
  oval 1.055x0.364 smd: 8(2.877,-1.95) 9(2.877,-1.3) 10(2.877,-0.65) 11(2.877,0) 12(2.877,0.65) 13(2.877,1.3) 14(2.877,1.95) 22(-2.877,1.95) 23(-2.877,1.3) 24(-2.877,0.65) 25(-2.877,0) 26(-2.877,-0.65) 27(-2.877,-1.3) 28(-2.877,-1.95)
  rect 3.7x3.7 smd: 29(0,0)
R0805
  rect 1.133x1.377 smd: 1(-0.967,0) 2(0.967,0)
RJ45-TH_R-RJ45R08P-A009
  round 1.5 hole 1: 1(3.57,1.27) 2(2.55,-1.27) 3(1.53,1.27) 4(0.51,-1.27) 5(-0.51,1.27) 6(-1.53,-1.27) 7(-2.55,1.27) 8(-3.57,-1.27)
SC-70-6_L2.2-W1.3-P0.65-LS2.1-BR
  rect 0.6x0.42 smd: 1(0.95,-0.65) 2(0.95,0) 3(0.95,0.65) 4(-0.95,0.65) 5(-0.95,0) 6(-0.95,-0.65)
SOD-123FL_L2.8-W1.7-LS3.6-RD
  rect 0.93x0.96 smd: 1(-1.585,0) 2(1.585,0)
SOP-16_L10.0-W3.9-P1.27-LS6.0-BL
  oval 0.56x1.745 smd: 1(-4.445,-2.873) 2(-3.175,-2.873) 3(-1.905,-2.873) 4(-0.635,-2.873) 5(0.635,-2.873) 6(1.905,-2.873) 7(3.175,-2.873) 8(4.445,-2.873) 9(4.445,2.873) 10(3.175,2.873) 11(1.905,2.873) 12(0.635,2.873) 13(-0.635,2.873) 14(-1.905,2.873) 15(-3.175,2.873) 16(-4.445,2.873)
SOT-23-6_L2.9-W1.6-P0.95-LS2.8-BL
  rect 0.532x1.072 smd: 1(-0.95,-1.149) 2(0,-1.149) 3(0.95,-1.149) 4(0.95,1.149) 5(0,1.149) 6(-0.95,1.149)
SOT-23-6_L2.9-W1.6-P0.95-LS2.8-BR
  rect 1x0.55 smd: 1(1.4,-0.95) 2(1.4,0) 3(1.4,0.95) 4(-1.4,0.95) 5(-1.4,0) 6(-1.4,-0.95)
SOT-25-5_L3.0-W1.8-P0.95-LS3.0-BR
  rect 1.105x0.623 smd: 1(1.397,-0.953) 2(1.397,0.013) 3(1.397,0.953) 4(-1.397,0.953) 5(-1.397,-0.927)
SW-TH_4P-L6.0-W6.0-P4.50-LS6.5
  round 1.8 hole 1.2: 1(-3.25,2.25) 2(3.25,2.25) 3(-3.25,-2.25) 4(3.25,-2.25)
TSSOP-24_L7.8-W4.4-P0.65-LS6.4-BL
  rect 0.4x1.65 smd: 1(-3.575,-3.022) 2(-2.925,-3.022) 3(-2.275,-3.022) 4(-1.625,-3.022) 5(-0.975,-3.022) 6(-0.325,-3.022) 7(0.325,-3.022) 8(0.975,-3.022) 9(1.625,-3.022) 10(2.275,-3.022) 11(2.925,-3.022) 12(3.575,-3.022) 13(3.575,3.022) 14(2.925,3.022) 15(2.275,3.022) 16(1.625,3.022) 17(0.975,3.022) 18(0.325,3.022) 19(-0.325,3.022) 20(-0.975,3.022) 21(-1.625,3.022) 22(-2.275,3.022) 23(-2.925,3.022) 24(-3.575,3.022)
USB-C-SMD_MC-107D
  oval 1.2x2.5 hole 0.7x1.8: 0(-4.32,1.892) 2(4.32,1.892)
  oval 1.2x2 hole 0.7x1.5: 1(-4.32,-2.308) 3(4.32,-2.308)
  rect 0.6x1.2 smd: A1B12(-3.2,2.308) A4B9(-2.4,2.308) B1A12(3.2,2.308) B4A9(2.4,2.308)
  rect 0.3x1.2 smd: A5(-1.25,2.308) A6(-0.25,2.308) A7(0.25,2.308) A8(1.25,2.308) B5(1.75,2.308) B6(0.75,2.308) B7(-0.75,2.308) B8(-1.75,2.308)
WIFIM-SMD_ESP-12F-ESP8266MOD
  rect 1.4x2.5 smd: 1(-7.651,-7.551) 2(-5.651,-7.551) 3(-3.651,-7.551) 4(-1.651,-7.551) 5(0.349,-7.551) 6(2.349,-7.551) 7(4.349,-7.551) 8(6.349,-7.551) 9(6.349,7.549) 10(4.349,7.55) 11(2.349,7.551) 12(0.349,7.551) 13(-1.651,7.55) 14(-3.651,7.551) 15(-5.651,7.551) 16(-7.651,7.551)
  rect 1.7x1.4 smd: 17(7.651,-5) 18(7.649,-3.002) 19(7.649,-1.004) 20(7.649,0.998) 21(7.649,2.997) 22(7.651,4.997)

## Nets
As in the schematic, except:
3.3V: C1.1 C7.1 C8.1 C10.1 C18.1 OLED.1 Q3.5 R1.1 R2.1 R6.1 R7.1 R10.1 R12.1 R17.1 R18.2 R19.1 R23.1 R24.1 R25.1 R26.1 R27.1 R28.1 R29.1 R30.1 R31.1 R32.1 R33.1 R34.1 R35.1 R36.1 R37.1 R38.2 RJ1.1 RJ2.1 RJ3.1 RJ4.1 RJ5.1 RJ6.1 RJ7.1 RJ8.1 U1.8 U2.24 U3.1 U3.3 U4.4 U4.16 U5.5 U9.1 U9.3 U10.1 U10.3 U11.1 U11.3 U12.1 U12.3 U13.1 U13.3 U14.1 U14.3 U15.1 U15.3 U16.1 U16.3
GND: C12.2 C14.2 Q2.1 R8.1 R9.2 R13.2 R16.2 U8.1 U8.3 USB1.0 USB1.1 USB1.2 USB1.3 USB1.A1B12 USB1.B1A12
GND-A: C1.2 C7.2 C8.2 C10.2 C18.2 C19.2 C20.2 OLED.2 Q3.2 R3.2 R4.2 R5.1 R20.1 RJ1.8 RJ2.8 RJ3.8 RJ4.8 RJ5.8 RJ6.8 RJ7.8 RJ8.8 SW2.3 SWITCH.1 U1.9 U2.12 U3.6 U3.7 U4.1 U5.6 U5.29 U9.6 U9.7 U10.6 U10.7 U11.6 U11.7 U12.6 U12.7 U13.6 U13.7 U14.6 U14.7 U15.6 U15.7 U16.6 U16.7
B+: C12.1 C20.1 CN1.2 D1.1 D1.2 D4.1 Q3.1 R11.2 R22.1 SWITCH.3 U8.5
D7: U1.7 U5.14
GPA3: U5.20
Q3_3: Q3.3 SWITCH.2
SCL: OLED.3 R10.2 R18.1 U1.14 U2.22 U3.5 U5.8
SDA: OLED.4 R12.2 R17.2 U1.13 U2.23 U3.4 U5.9
U2_3: R1.2 U2.3

Pads without a net: Q2 2 5; Q3 4; RJ1 2 7; RJ2 2 7; RJ3 2 5 7; RJ4 2 7; RJ5 2 7; RJ6 2 7; RJ7 2 7; RJ8 2 7; SW2 1 4; U1 4 17 18 19 20 21 22; U3 2; U4 7 8 9 10 11 12 15; U5 7 10; U6 4; U8 9; U9 2; U10 2; U11 2; U12 2; U13 2; U14 2; U15 2; U16 2; USB1 A8 B8

## Via types
v1: diameter 0.61, hole 0.305, Top Layer to Bottom Layer, 7 vias
v2: diameter 0.62, hole 0.305, Top Layer to Bottom Layer, 79 vias
v3: diameter 0.63, hole 0.305, Top Layer to Bottom Layer, 1 via

## Routing (per net, layer and track width the routed paths; a pad name or vN(x,y) marks a point on that pad's centre or on a via; arc(x,y) is an arc through that point)
3.3V: length 211.7
  Top Layer w0.254: U2.24 42.16,38.28 v2(43.48,38.28) ; 37.71,15.32 28.55,15.32 U1.8 ; 37.71,15.32 37.71,12.05 RJ5.1 ; 37.71,15.32 36.25,16.78 36.11,16.78 ; 37.71,15.32 39.01,14.02 47.16,14.02 49.02,15.88 U4.4 49.02,19.02 45.21,22.83 U4.16 ; 1.23,56.57 2.38,57.71 4.99,57.71 5.68,57.03 5.68,56.57 5.88,56.57 9.82,60.5 v2(10.84,60.5) ; U5.5 39.28,39.96 v2(39.28,38.28) ; 37.22,11.55 37.22,11.01 40.81,7.67 52.36,7.67 53.38,8.69 53.38,10.63 52.46,11.55 ; v2(1.95,20.37) 3.17,21.59 R38.2 ; U11.1 13.38,30.65 v2(13.88,30.15) 14.38,30.65 U11.3 ; U12.3 10.08,58.23 10.33,58.47 v2(10.84,58.47) 11.08,58.23 U12.1 ; 46.49,21.54 47.1,22.15 52.87,22.15 53.51,22.78 53.51,25.38 R6.1 53.84,25.88 R33.1 60.27,32.31 v2(63.16,32.31) ; U14.3 66.6,32.17 v2(66.84,31.93) 66.84,31.55 66.47,31.17 65.98,31.17 ; U13.3 69.64,58.34 v2(70.14,57.84) 69.64,57.34 U13.1 ; 65.83,36.58 RJ7.1 ; 16.22,30.45 14.39,28.63 11.62,28.63 RJ4.1 ; 16.22,30.45 16.25,30.45 17.06,29.64 18.33,29.64 20.57,31.88 R19.1 ; 16.22,30.45 R27.1 ; v2(63.92,59.11) 63.97,59.16 R30.1 63.97,63.55 68.24,63.55 68.49,63.55 68.49,61.85 R31.1
  Bottom Layer w0.254: 66.84,31.93 67.22,32.69 67.22,35.37 RJ7.1 65.53,36.58 63.16,34.21 v2(63.16,32.31) ; v2(10.84,58.47) v2(10.84,60.5) ; v2(10.84,58.47) 12.61,56.69 12.61,44.75 11.55,43.69 11.55,43.54 ; v2(10.84,58.47) 12.97,60.6 OLED.1 ; v2(43.48,38.28) v2(39.28,38.28) ; RJ4.1 12.29,28.56 v2(13.88,30.15) ; 11.55,28.56 8.04,24.94 4.1,24.94 1.95,23.67 v2(1.95,20.37) ; v2(70.14,57.84) 68.45,56.14 RJ8.1 63.92,56.22 v2(63.92,59.11) ; 28.94,68.45 28.49,68.9
GND: length 42.6
  Top Layer w0.254: USB1.B1A12 72.97,12.27 73.47,12.77 ; 73.47,12.77 72.56,13.68 C14.2 ; 73.47,12.77 74.42,13.72 U8.1 ; U8.3 77.59,10.95 USB1.3 ; Q2.1 v2(67.86,13.94) ; USB1.0 63.17,10.85 61.52,10.85
  Bottom Layer w0.254: USB1.0 70.33,3.69 USB1.3 73.47,12.77 69.03,12.77 v2(67.86,13.94)
GND-A: length 173.9
  Top Layer w0.254: v2(70.02,56.44) 68.75,56.44 67.86,57.33 U13.7 67.36,57.34 U13.6 ; 39.95,39.97 39.95,41.55 U5.29 ; U12.6 11.08,56.19 U12.7 9.82,56.69 9.06,55.93 v2(9.06,55.17) ; 38.9,17.72 v2(37.51,17.7) ; U14.6 64.57,31.17 U14.7 v2(65.07,30.15) ; 25.23,26.16 25.23,29.61 26.52,30.89 ; U11.6 13.38,32.43 U11.7 ; U2.12 20.46,30.89 16.72,27.15 ; R20.1 1.31,23.88 1.31,35.61 v2(3.22,35.61) ; Q3.2 39.85,17.72 40.75,16.82 45.01,16.82 45.21,17.01 U4.1
  Bottom Layer w0.254: 36.08,70.99 36.11,71.02 36.11,76 37.25,77.14 47.16,77.14 51.19,73.11 51.19,70.98 58.65,70.98 71.03,58.6 71.03,57.46 v2(70.02,56.44) 72.18,54.28 72.18,45.75 RJ8.8 ; v2(37.51,17.7) 36.87,18.34 SWITCH.1 ; 16.04,62.4 11.21,62.4 7.66,58.85 7.66,56.06 8.55,55.17 v2(9.06,55.17) 9.01,55.12 RJ3.8 8.51,50.68 7.66,49.84 7.66,37.05 RJ4.8 3.3,35.7 v2(3.22,35.61)
  vias: v2(39.16,35.61)
(no net):
  vias: v1(68.96,16.12)
A0: length 1.3
  Top Layer w0.254: U5.13 U5.11
B+: length 105.8
  Top Layer w0.254: D1.2 68.94,2.97 v2(69.13,2.97) ; C20.1 60.92,21.94 D4.1 ; 66.91,19.93 66.8,16.95 67.47,16.28 ; 65.13,3.61 65.13,4.28 CN1.2 60.49,8.92 60.49,12.62 62.48,14.61 65.84,14.61 ; 65.85,14.61 65.85,14.64 67.47,16.26 ; Q3.1 38.9,16.69 v2(40.3,15.29) ; v2(68.24,1.07) 24.55,1.07 24.3,1.32 R22.1 ; 59.72,23.14 58.46,23.55 57.06,23.55 52.75,19.23 v2(50.46,19.23)
  Bottom Layer w0.254: v2(69.13,2.97) 69.13,1.96 v2(68.24,1.07) ; v2(50.46,19.23) 49.19,19.23 45.25,15.29 43.73,15.29 v2(40.3,15.29) 41.95,16.94 SWITCH.3
B-: length 62.1
  Top Layer w0.254: 59.12,10.5 59.46,10.85 59.24,10.63 CN1.1 64.58,2.34 72.31,2.34 79.5,9.52 79.5,18.91 78.86,19.54 78.86,21.15 78.05,21.97 ; 78.05,21.97 78.05,24.3 77.72,24.63 65.23,24.63 61.57,21.94
D+: length 28.7
  Top Layer w0.254: U4.5 50.21,17.74 v2(50.21,16.43) ; USB1.A6 70.64,9.14 v2(71.11,9.14) 71.37,9.39 71.37,9.9 70.73,10.54 USB1.B6
  Bottom Layer w0.254: v2(50.21,16.43) 57.5,9.14 v2(71.11,9.14)
D-: length 25.7
  Top Layer w0.254: U4.6 51.48,17.74 v2(51.48,16.18) ; USB1.B7 68.53,10.54 v3(68.07,10.54) 68.19,10.66 69.82,10.66 USB1.A7
  Bottom Layer w0.254: v2(51.48,16.18) 58.08,9.58 66.21,9.58 v3(68.07,10.54)
DTR: length 3.9
  Top Layer w0.254: U4.13 48.55,24.03 Q1.2 48.55,25.83 49.2,26.48 49.2,27.04
GPA1: length 26.4
  Top Layer w0.254: U5.18 38.65,46.15 v2(40.3,47.8)
  Bottom Layer w0.254: v2(40.3,47.8) 40.3,48.56 33.02,55.85 33.02,68.45
GPA2: length 33.6
  Top Layer w0.254: U5.19 38.01,45.74 v2(38.01,46.91)
  Bottom Layer w0.254: RJ4.5 25.83,46.91 38.01,46.91
GPA4: length 34.8
  Top Layer w0.254: 36.7,45.73 36.7,47 38.39,48.69 68.45,48.69 RJ8.5
GPA5: length 47.8
  Top Layer w0.254: U5.22 35.44,45.14 v2(34.08,45.14)
  Bottom Layer w0.254: v2(34.08,45.14) 32.43,43.61 32.43,40.06 35.22,37.26 57.06,37.26 63.03,31.29 67.23,31.29 RJ7.5
GPA6: length 41.1
  Top Layer w0.254: v2(37.76,26.21) 37.76,31.93 38.65,32.82 ; v2(34.2,44.25) 35.67,44.25 U5.23 ; v2(33.44,40.06) 34.71,38.79 36.62,38.79 37.38,38.02 v2(37.38,35.87)
  Bottom Layer w0.254: v2(34.2,44.25) 33.44,43.49 v2(33.44,40.06) ; v2(37.38,35.87) 38.52,35.87 38.78,35.61 38.78,32.94 v2(38.56,32.72) ; RJ5.5 33.14,21.59 v2(37.76,26.21)
GPA7: length 1.1
  Top Layer w0.254: U5.24 35.76,43.49 v1(34.71,43.49)
GPB0: length 39.1
  Top Layer w0.254: RJ1.4 46.03,72.06 44.11,72.06 38.78,66.73 38.78,52.63 33.31,47.17 33.31,43.74 34.2,42.85 35.77,42.85
GPB1: length 37.5
  Top Layer w0.254: U5.26 33.97,42.2 32.43,43.74 32.43,52.76 v2(35.09,55.42)
  Bottom Layer w0.254: v2(35.09,55.42) 35.22,63.04 37.63,65.46 37.63,68.5 36.36,69.77 33.21,69.77 32,70.99
GPB2: length 32.6
  Top Layer w0.254: U5.27 19.38,41.55 v2(19.35,41.58)
  Bottom Layer w0.254: v2(19.35,41.58) 16.04,41.58 10.45,35.99 10.45,33.06 RJ4.4
GPB3: length 30.4
  Top Layer w0.254: U5.28 35.73,40.95 v2(28.49,40.95) ; v2(18.33,42.47) 27.09,42.47 v2(27.22,42.34)
  Bottom Layer w0.254: RJ3.4 10.2,45.41 10.2,43.23 10.96,42.47 v2(18.33,42.47) ; 27.22,42.34 v2(28.49,40.94)
GPB4: length 41.2
  Top Layer w0.254: v2(35.86,40.06) 35.94,39.97 U5.1
  Bottom Layer w0.254: 35.85,40.06 65.19,40.06 69.64,44.5 69.64,47.29 70.99,48.64
GPB5: length 38.5
  Top Layer w0.254: U5.2 37.35,38.94 v2(37.38,38.91)
  Bottom Layer w0.254: v2(37.38,38.91) 68.24,38.91 69.76,37.39 69.76,34.74 RJ7.4
GPI0: length 49
  Top Layer w0.254: 12.48,22.91 13.87,21.51 14.01,21.51 ; v2(50.21,26.85) 51.35,25.71 R6.2 51.34,25.14 Q1.3
  Bottom Layer w0.254: 13.89,21.51 16.69,18.72 22.65,18.72 31.79,27.86 49.32,27.86 50.21,26.97 v2(50.21,26.85)
  vias: v2(13.89,21.51)
GPI2: length 30
  Top Layer w0.254: 1.31,16.53 1.4,16.43 v2(3.47,16.43) ; 13.25,24.69 13.52,24.69 13.89,24.32 13.89,24.18 v2(15.41,22.66) ; v2(21.12,27.99) 21.12,29.95
  Bottom Layer w0.254: v2(21.12,27.99) 15.79,22.66 v2(15.41,22.66) 15.03,23.04 12.61,23.04 6.01,16.43 v2(3.47,16.43)
GPI015: length 13.8
  Top Layer w0.254: U1.10 14.32,26.72 8.3,26.72 6.52,24.94 4.23,24.94 3.17,23.8
IN+: length 33.8
  Top Layer w0.254: 71.82,11.71 72.26,11.26 72.26,8.76 71.37,7.87 68.86,7.87 USB1.A4B9 68.36,8.31 v2(66.33,10.34) ; 55.3,13.4 v1(55.37,13.33) 55.37,15.74 59.33,19.7 56.4,19.7 56.34,19.77
  Bottom Layer w0.254: v1(55.37,13.33) 58.36,10.34 v2(66.33,10.34)
LED1_1: length 44.7
  Top Layer w0.254: v2(64.18,15.93) 62.8,15.93 62.73,16 61.86,16.87 LED1.1 ; U8.4 78.86,14.22 78.1,14.98 75.18,14.98 74.8,15.36 74.8,18.28 75.05,18.54 75.05,19.54 74.91,19.68 v1(73.15,19.68) ; 72.99,19.53 72.56,19.09 C14.1 ; C15.2 57.45,21.57 v2(57.45,22.78) ; LED4.1 58.83,13.33 60.56,13.33 63.16,15.93 64.18,15.93
  Bottom Layer w0.254: v2(57.45,22.78) 64.18,16.05 v2(64.18,15.93) 67.93,19.68 v1(73.15,19.68)
LED1_2: length 10.4
  Top Layer w0.254: R15.1 69.88,21.46 66.16,21.46 63.35,18.64 63.35,18.39
LED2_2: length 3.2
  Top Layer w0.254: LED2.2 1.23,18.7 R38.1
LED4_2: length 12.3
  Top Layer w0.254: R14.1 64,22.73 59.43,18.16 59.43,15.7 LED4.2
Q3_3: length 4.5
  Top Layer w0.254: Q3.3 40.36,18.66 v2(40.43,18.72)
  Bottom Layer w0.254: v2(40.43,18.72) 40.43,20.24 SWITCH.2
R21_2: length 37.1
  Top Layer w0.254: v2(47.41,16.43) 47.75,16.77 U4.3 ; v2(36.87,13.51) 19.6,13.51 R21.2
  Bottom Layer w0.254: v2(47.41,16.43) 44.49,13.51 v2(36.87,13.51)
R22_2: length 7.7
  Top Layer w0.254: U1.2 18.91,6.84 19.35,6.4 19.35,3.28 R22.2
RST: length 59.9
  Top Layer w0.254: 33.01,24.74 44.8,24.74 v2(47.16,27.1) 47.84,27.1 47.91,27.04 ; v2(14.65,9.32) 14.75,9.32 U1.1
  Bottom Layer w0.254: v2(14.65,9.32) 14.65,9.58 32.17,27.1 47.16,27.1
RTS: length 3.8
  Top Layer w0.254: U4.14 47.91,23.73 Q1.1 47.91,26.07 48.55,26.72 48.55,27.04
RX: length 41
  Top Layer w0.254: U1.15 9.63,17.27 25.88,17.27 27.98,19.35 45.97,19.43 46.48,18.92 U4.2
S$15651:
  vias: v1(68.32,15.49) v1(69.59,16.76)
S$27881: length 0.4
  Top Layer w0.254: 5.63,20.88 6.01,20.88
SC1: length 48
  Top Layer w0.254: v2(30.65,46.28) 27.73,49.2 27.73,68.89 28.49,69.65 32.17,69.65 33.51,70.99 34.04,70.99 ; U2.7 31.35,34.14 30.65,34.85 v2(30.65,40.18)
  Bottom Layer w0.254: v2(30.65,40.18) v2(30.65,46.28)
SC2: length 33.1
  Top Layer w0.254: 18.15,31.55 18.18,33.07 ; RJ4.6 9.01,34.17 10.96,36.12 12.99,36.12 16.04,33.07 33.82,33.07 U2.9 ; 15.41,33.7 14.39,33.7 13.88,33.2 U11.5
SC3: length 57.5
  Top Layer w0.254: 22.14,34.09 17.19,34.09 10.2,41.07 10.2,47.45 RJ3.6 10.58,50.21 U12.5 10.58,55.17 10.96,54.79 12.11,54.79 12.49,55.17 12.49,57.71 11.09,59.11 9.82,59.11 7.61,56.9 R29.2 ; v2(24.68,31.55) 35.88,31.55 U2.11
  Bottom Layer w0.254: v2(22.14,34.09) v2(24.68,31.55)
SC4: length 61.5
  Top Layer w0.254: v2(40.3,31.55) 41.92,31.55 U2.14 ; 70.35,61.77 70.91,61.21 70.91,56.05 69.51,54.65 ; 70.99,46.6 69.51,48.07 69.51,55.3 68.87,55.93 66.72,55.93 66.21,56.44 66.21,57.58 66.46,57.84 U13.5 ; v2(43.35,33.45) 57.84,33.45 RJ8.6
  Bottom Layer w0.254: v2(40.3,31.55) 42.2,33.45 v2(43.35,33.45)
SC5: length 36
  Top Layer w0.254: RJ7.6 68.88,29.39 63.92,29.39 61.76,31.55 ; R33.2 60.54,30.33 v2(61.76,31.55) 61.89,31.67 64.15,31.67 ; U2.16 43.83,32.84 v2(43.86,32.82)
  Bottom Layer w0.254: v2(61.76,31.55) 60.49,32.82 v2(43.86,32.82)
SC6: length 33.1
  Top Layer w0.254: v2(36.49,26.21) 36.49,31.8 38.83,34.14 U2.18
  Bottom Layer w0.254: v2(36.49,26.21) 29.76,19.48 29.76,11.1 31.85,9.01 RJ5.6
SCL: length 83.6
  Top Layer w0.254: v2(22.39,20.12) 22.36,20.08 U1.14 ; 41.93,36.75 40.93,36.75 39.28,35.1 v2(38.14,35.1) 38.14,35.87 41.53,39.25 U5.8 41.61,40.82 v2(42.71,40.82)
  Bottom Layer w0.254: 42.71,40.82 42.71,43.23 21.75,64.2 17.83,64.2 ; v2(38.14,35.1) 23.16,20.12 v2(22.39,20.12)
SD1: length 37.6
  Top Layer w0.254: 31.54,40.31 31.54,35.99 32.74,34.79 U2.6 ; v2(31.54,46.28) 31.54,68 31.09,68.45 RJ2.3
  Bottom Layer w0.254: v2(31.54,40.31) v2(31.54,46.28)
SD2: length 63.3
  Top Layer w0.254: U11.4 14.9,32.32 ; R26.2 19.42,34.93 v2(19.35,34.85) ; 14.91,32.32 15.03,32.2 15.03,29.9 14.65,29.52 12.63,29.52 11.55,30.6 11.16,30.6 10.58,30.02 10.58,29.01 9.18,27.61 7.91,27.61 7.41,28.12 7.41,36.5 8.3,37.39 12.99,37.39 16.89,33.49 35.88,33.49
  Bottom Layer w0.254: v2(19.35,34.85) 15.81,34.85 RJ4.3
SD3: length 49.2
  Top Layer w0.254: 11.55,45.58 13.57,45.58 24.68,34.47 v2(26.96,34.47) ; R28.2 4.31,55.42 7.41,55.42 9.82,53.01 v2(9.82,52.88) 9.82,55.51 U12.4 ; 35.88,32.19 v2(31.92,32.18)
  Bottom Layer w0.254: v2(31.92,32.18) 29.63,34.47 v2(26.97,34.47) ; v2(9.82,52.88) 9.95,52.88 10.33,52.5 10.33,46.81 RJ3.3
SD4: length 55.8
  Top Layer w0.254: v2(39.67,30.91) 41.91,30.91 U2.13 ; v2(60.11,49.33) 68.12,49.33 RJ8.3 65.7,52.41 65.7,58.09 65.95,58.34 U13.4 65.9,59.37 R30.2 ; v2(44.62,34.85) 46.4,34.85 v2(53.25,41.71)
  Bottom Layer w0.254: v2(60.11,49.33) 60.11,48.57 v2(53.25,41.71) ; v2(39.67,30.91) 39.67,33.96 40.55,34.85 v2(44.62,34.85)
SD5: length 31
  Top Layer w0.254: 41.93,32.19 41.93,32.05 54.4,32.06 56.17,32.82 61.76,32.94 65.04,33.07 ; R32.2 65.93,34.54 RJ7.3 65.04,33.07 ; U14.4 65.04,33.07
SD6: length 25.6
  Top Layer w0.254: U2.17 40.47,33.49 38.9,31.93 v2(38.9,26.21)
  Bottom Layer w0.254: v2(38.9,26.21) 35.18,22.49 RJ5.3
SDA: length 85.3
  Top Layer w0.254: v2(10.46,23.55) 10.46,22.1 U1.13 ; v2(43.86,43.23) 43.86,43.1 42.3,41.55 U5.9 ; 41.53,41.55 43.51,41.55 44.62,40.44 44.62,37.9 44.11,37.39 U2.23 40.69,37.39 v2(39.79,36.5)
  Bottom Layer w0.254: v2(43.86,43.23) 21.1,65.99 OLED.4 ; v2(39.79,36.5) 23.41,36.5 v2(10.46,23.55)
TX: length 12.4
  Top Layer w0.254: 6.82,17.25 6.82,14.86 12.61,9.07 R21.1
U6_1: length 7.2
  Top Layer w0.254: 69.1,14.64 69.1,13.6 67.81,12.31 65.4,12.31 64.77,12.95 64.18,12.95 Q2.4
U6_3: length 9.2
  Top Layer w0.254: U6.3 71.24,15.18 71.24,14.47 68.06,11.29 Q2.6
U6_5: length 11.4
  Top Layer w0.254: 76.12,21.97 74.28,21.97 72.25,19.93 68.97,19.93 ; C13.1 68.59,19.55 68.19,18.92 67.81,17.27 68.14,16.94
U8_6: length 7.1
  Top Layer w0.254: R15.2 76.62,23.16 77.08,22.7 77.08,20.04 77.59,19.53
U8_7: length 10.2
  Top Layer w0.254: R14.2 68.96,22.73 v2(69.97,23.74) ; v1(74.42,20.57) 75.43,20.57 76.32,19.68 76.32,19.54
  Bottom Layer w0.254: v2(69.97,23.74) 73.15,20.57 v1(74.42,20.57)
